# EAGLE design SolarCharger_Rev2 (EAGLE 7.6.0)

## Sheet 1 of 5
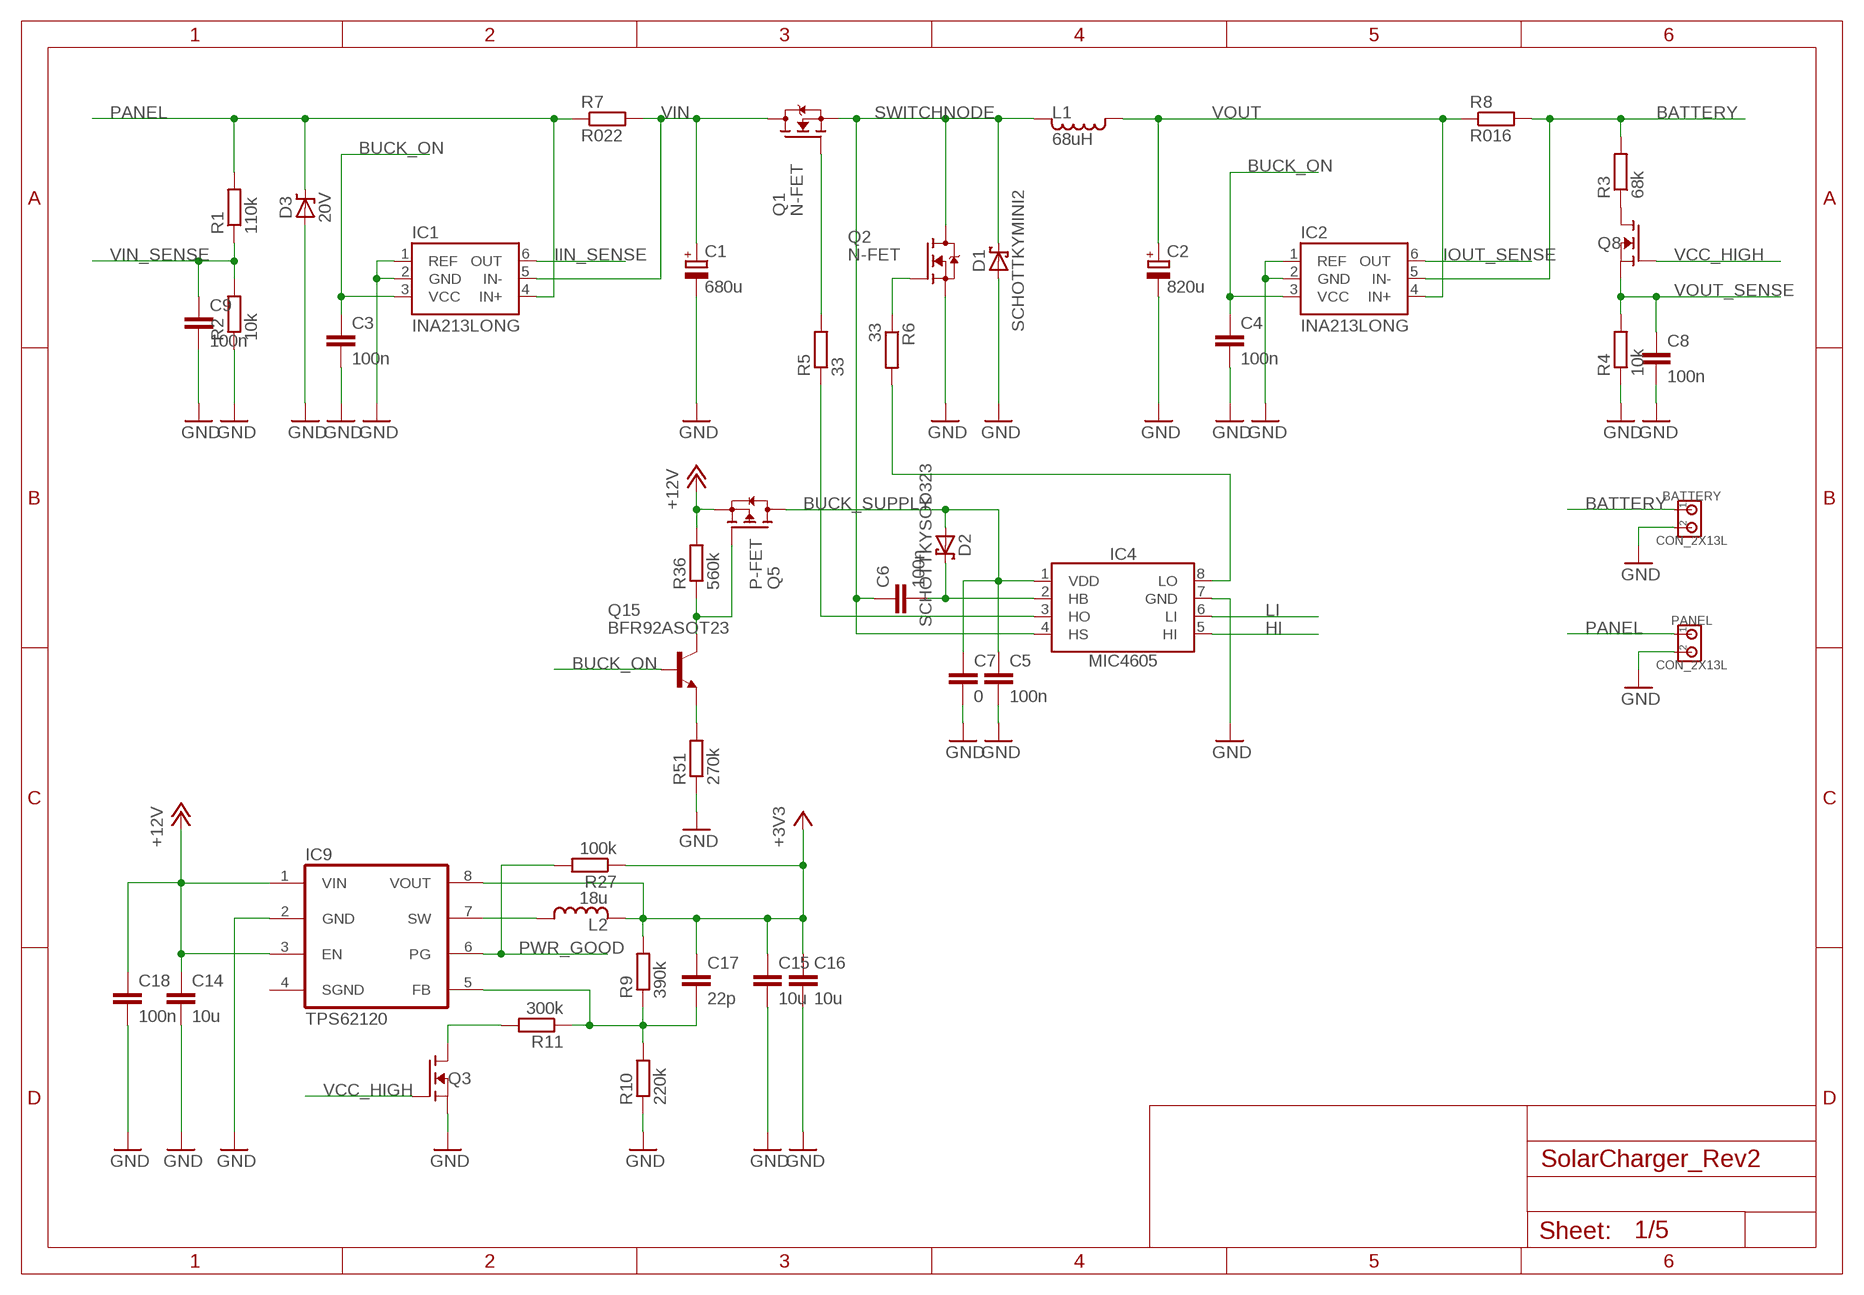
[diagram p0: schematic, sheet 1]

### Parts
BATTERY  CON_2X13L  [200MIL_2X]
C1  680u  C_POLARIZED10MM  [10MM]
C2  820u  C_POLARIZED10MM  [10MM]
C3  100n  CC0805  [C0805]
C4  100n  CC0805  [C0805]
C5  100n  CC0805  [C0805]
C6  100n  CC0805  [C0805]
C7  0  CC0805  [C0805]
C8  100n  CC0805  [C0805]
C9  100n  CC0805  [C0805]
C14  10u  CC1206  [C1206]
C15  10u  CC0805  [C0805]
C16  10u  CC0805  [C0805]
C17  22p  CC0805  [C0805]
C18  100n  CC1206  [C1206]
D1  SCHOTTKYMINI2  [MINI2-F3-B]
D2  SCHOTTKYSOD323  [SOD323]
D3  20V  ZENERSMC  [SMC]
IC1  INA213LONG  [SC70-6_LONG]
IC2  INA213LONG  [SC70-6_LONG]
IC4  MIC4605  [SOIC8]
IC9  TPS62120  [SOT-23-8]
L1  68uH  INDUCTORMSS1583  [MSS1583]
L2  18u  INDUCTORLPS3015  [LPS3015]
PANEL  CON_2X13L  [200MIL_2X]
Q1  N-FET  N-PWR-MOSFETTO263-3  [TO263-3]
Q2  N-FET  N-PWR-MOSFETTO263-3  [TO263-3]
Q3  N-FETSOT23  [SOT23]
Q5  P-FET  [SOT23]
Q8  N-FETSOT23  [SOT23]
Q15  BFR92ASOT23  [SOT23]
R1  110k  RESISTORR0805  [R0805]
R2  10k  RESISTORR0805  [R0805]
R3  68k  RESISTORR0805  [R0805]
R4  10k  RESISTORR0805  [R0805]
R5  33  RESISTORR0805  [R0805]
R6  33  RESISTORR0805  [R0805]
R7  R022  RESISTOR0612  [0612]
R8  R016  RESISTOR0612  [0612]
R9  390k  RESISTORR0805  [R0805]
R10  220k  RESISTORR0805  [R0805]
R11  300k  RESISTORR0805  [R0805]
R27  100k  RESISTORR0805  [R0805]
R36  560k  RESISTORR0805  [R0805]
R51  270k  RESISTORR0805  [R0805]

### Nets
BATTERY: BATTERY.1 IC2.5(IN-) R3.2 R8.2 ; also sheet 4,5
BUCK_ON: C3.1 C4.1 IC1.3(VCC) IC2.3(VCC) Q15.1(B) ; also sheet 2
BUCK_SUPPLY: C5.1 C7.1 D2.A IC4.1(VDD) Q5.3(D)
GND: BATTERY.2 C1.- C2.- C3.2 C4.2 C5.2 C7.2 C8.2 C9.2 C14.2 C15.2 C16.2 C18.2 D1.A D3.A IC1.1(REF) IC1.2(GND) IC2.1(REF) IC2.2(GND) IC4.7(GND) IC9.2(GND) PANEL.2 Q2.3(S) Q3.2(S) R2.1 R4.1 R10.1 R51.1 ; also sheet 2,3,4,5
HI: IC4.5(HI) ; also sheet 2
IIN_SENSE: IC1.6(OUT) ; also sheet 3
IOUT_SENSE: IC2.6(OUT) ; also sheet 3
LI: IC4.6(LI) ; also sheet 2
N$1: C6.2 D2.C IC4.2(HB)
N$4: Q1.1(G) R5.2
N$5: Q3.3(D) R11.2
N$7: Q2.1(G) R6.1
N$8: IC4.8(LO) R6.2
N$9: IC9.7(SW) L2.1
N$11: C17.2 IC9.5(FB) R9.1 R10.2 R11.1
N$14: IC4.3(HO) R5.1
N$16: Q5.1(G) Q15.3(C) R36.1
N$17: Q8.3(D) R3.1
N$19: Q15.2(E) R51.2
PANEL: D3.C IC1.4(IN+) PANEL.1 R1.2 R7.1
PWR_GOOD: IC9.6(PG) R27.2 ; also sheet 2
SWITCHNODE: C6.1 D1.C IC4.4(HS) L1.2 Q1.3(S) Q2.TAB(D)
VCC: C15.1 C16.1 C17.1 IC9.8(VOUT) L2.2 R9.2 R27.1 ; supply symbol labelled +3V3 ; also sheet 2,3
VCC_HIGH: Q3.1(G) Q8.1(G) ; also sheet 2,4
VIN: C1.+ IC1.5(IN-) Q1.TAB(D) R7.2
VIN_SENSE: C9.1 R1.1 R2.2 ; also sheet 3
VOUT: C2.+ C14.1 C18.1 IC2.4(IN+) IC9.1(VIN) IC9.3(EN) L1.1 Q5.2(S) R8.1 R36.2 ; supply symbol labelled +12V ; also sheet 3
VOUT_SENSE: C8.1 Q8.2(S) R4.2 ; also sheet 3
Unconnected: IC9.4(SGND)

## Sheet 2 of 5
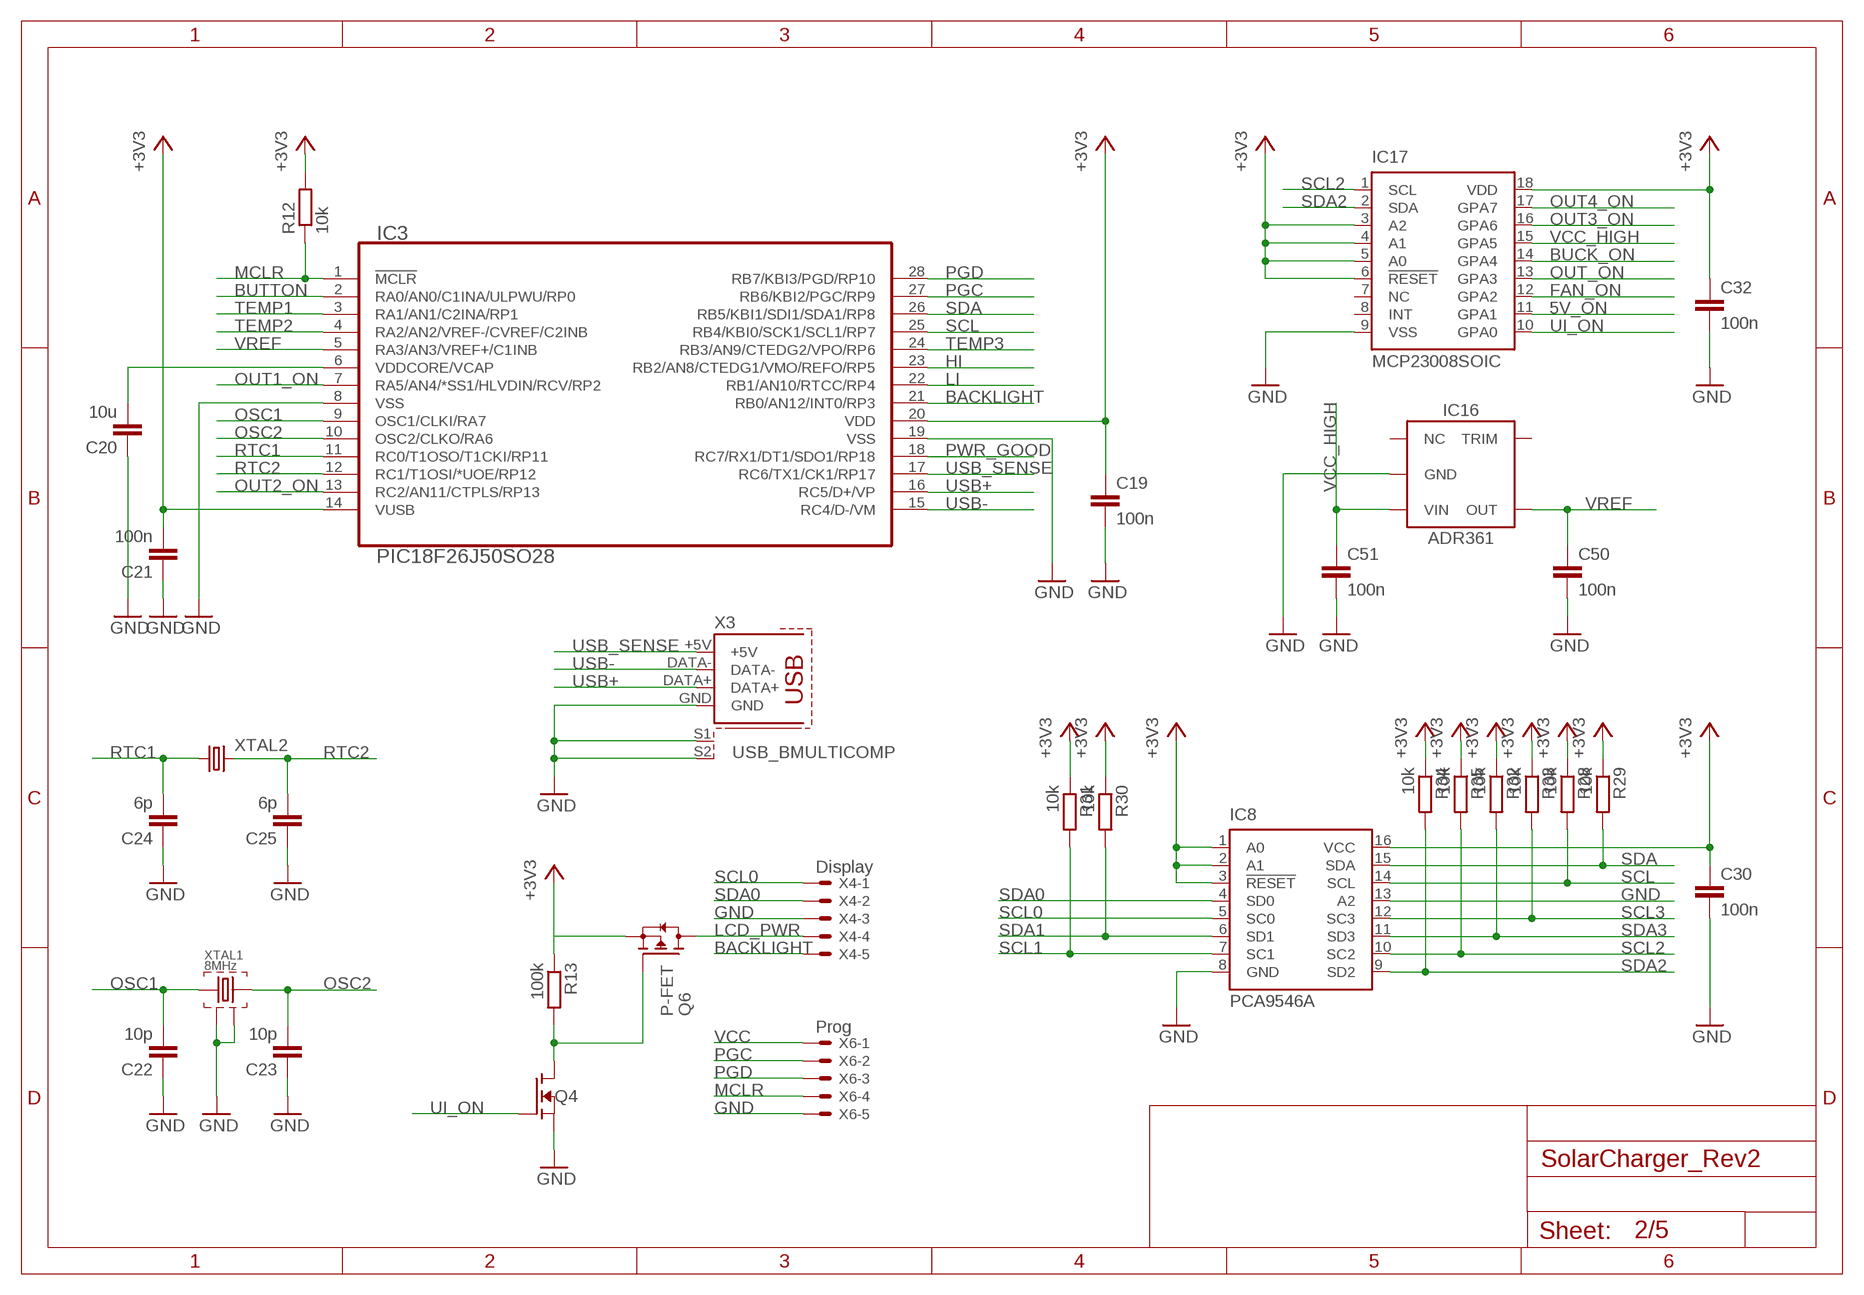
[diagram p1: schematic, sheet 2]

### Parts
C19  100n  CC0805  [C0805]
C20  10u  CC0805  [C0805]
C21  100n  CC0805  [C0805]
C22  10p  CC0805  [C0805]
C23  10p  CC0805  [C0805]
C24  6p  CC0805  [C0805]
C25  6p  CC0805  [C0805]
C30  100n  CC0805  [C0805]
C32  100n  CC0805  [C0805]
C50  100n  CC0805  [C0805]
C51  100n  CC0805  [C0805]
IC3  PIC18F26J50SO28  [SO28W]
IC8  PCA9546A  [SO16]
IC16  ADR361  [SOT23-5]
IC17  MCP23008SOIC  [SO18W]
Q4  N-FETSOT23  [SOT23]
Q6  P-FET  [SOT23]
R12  10k  RESISTORR0805  [R0805]
R13  100k  RESISTORR0805  [R0805]
R28  10k  RESISTORR0805  [R0805]
R29  10k  RESISTORR0805  [R0805]
R30  10k  RESISTORR0805  [R0805]
R31  10k  RESISTORR0805  [R0805]
R32  10k  RESISTORR0805  [R0805]
R33  10k  RESISTORR0805  [R0805]
R34  10k  RESISTORR0805  [R0805]
R35  10k  RESISTORR0805  [R0805]
X3  USB_BMULTICOMP  [USB_B]
X4  Display  22-23-2051  [22-23-2051]
X6  Prog  22-23-2051  [22-23-2051]
XTAL1  8MHz  CRYSTAL_SHIELDED  [5X3.2MM]
XTAL2  CRYSTAL3.2X1.5  [3.2X1.5MM]

### Nets
5V_ON: IC17.11(GPA1) ; also sheet 4
BACKLIGHT: IC3.21(RB0/AN12/INT0/RP3) X4.5
BUCK_ON: IC17.14(GPA4) ; also sheet 1
BUTTON: IC3.2(RA0/AN0/C1INA/ULPWU/RP0) ; also sheet 3
FAN_ON: IC17.12(GPA2) ; also sheet 3
GND: C19.2 C20.1 C21.1 C22.1 C23.1 C24.1 C25.1 C30.2 C32.2 C50.2 C51.2 IC3.8(VSS) IC3.19(VSS) IC8.8(GND) IC8.13(A2) IC16.2(GND) IC17.9(VSS) Q4.2(S) X3.GND X3.S1 X3.S2 X4.3 X6.5 XTAL1.2 XTAL1.4 ; also sheet 1,3,4,5
HI: IC3.23(RB2/AN8/CTEDG1/VMO/REFO/RP5) ; also sheet 1
LCD_PWR: Q6.3(D) X4.4
LI: IC3.22(RB1/AN10/RTCC/RP4) ; also sheet 1
MCLR: IC3.1(!MCLR!) R12.1 X6.4
N$2: Q4.3(D) Q6.1(G) R13.2
N$15: C20.2 IC3.6(VDDCORE/VCAP)
OSC1: C22.2 IC3.9(OSC1/CLKI/RA7) XTAL1.1
OSC2: C23.2 IC3.10(OSC2/CLKO/RA6) XTAL1.3
OUT1_ON: IC3.7(RA5/AN4/*SS1/HLVDIN/RCV/RP2) ; also sheet 5
OUT2_ON: IC3.13(RC2/AN11/CTPLS/RP13) ; also sheet 5
OUT3_ON: IC17.16(GPA6) ; also sheet 5
OUT4_ON: IC17.17(GPA7) ; also sheet 5
OUT_ON: IC17.13(GPA3) ; also sheet 5
PGC: IC3.27(RB6/KBI2/PGC/RP9) X6.2 ; also sheet 3
PGD: IC3.28(RB7/KBI3/PGD/RP10) X6.3 ; also sheet 3
PWR_GOOD: IC3.18(RC7/RX1/DT1/SDO1/RP18) ; also sheet 1
RTC1: C24.2 IC3.11(RC0/T1OSO/T1CKI/RP11) XTAL2.1
RTC2: C25.2 IC3.12(RC1/T1OSI/*UOE/RP12) XTAL2.2
SCL: IC3.25(RB4/KBI0/SCK1/SCL1/RP7) IC8.14(SCL) R28.2
SCL0: IC8.5(SC0) X4.1
SCL1: IC8.7(SC1) R31.2 ; also sheet 3
SCL2: IC8.10(SC2) IC17.1(SCL) R35.2
SCL3: IC8.12(SC3) R33.2 ; also sheet 3
SDA: IC3.26(RB5/KBI1/SDI1/SDA1/RP8) IC8.15(SDA) R29.2
SDA0: IC8.4(SD0) X4.2
SDA1: IC8.6(SD1) R30.2 ; also sheet 3
SDA2: IC8.9(SD2) IC17.2(SDA) R34.2
SDA3: IC8.11(SD3) R32.2 ; also sheet 3
TEMP1: IC3.3(RA1/AN1/C2INA/RP1) ; also sheet 4
TEMP2: IC3.4(RA2/AN2/VREF-/CVREF/C2INB) ; also sheet 4
TEMP3: IC3.24(RB3/AN9/CTEDG2/VPO/RP6) ; also sheet 4
UI_ON: IC17.10(GPA0) Q4.1(G) ; also sheet 3
USB+: IC3.16(RC5/D+/VP) X3.DATA+
USB-: IC3.15(RC4/D-/VM) X3.DATA-
USB_SENSE: IC3.17(RC6/TX1/CK1/RP17) X3.+5V
VCC: C19.1 C21.2 C30.1 C32.1 IC3.14(VUSB) IC3.20(VDD) IC8.1(A0) IC8.2(A1) IC8.3(!RESET!) IC8.16(VCC) IC17.3(A2) IC17.4(A1) IC17.5(A0) IC17.6(!RESET) IC17.18(VDD) Q6.2(S) R12.2 R13.1 R28.1 R29.1 R30.1 R31.1 R32.1 R33.1 R34.1 R35.1 X6.1 ; supply symbol labelled +3V3 ; also sheet 1,3
VCC_HIGH: C51.1 IC16.3(VIN) IC17.15(GPA5) ; also sheet 1,4
VREF: C50.1 IC3.5(RA3/AN3/VREF+/C1INB) IC16.4(OUT)
Unconnected: IC16.1(NC) IC16.5(TRIM) IC17.7(NC) IC17.8(INT)

## Sheet 3 of 5
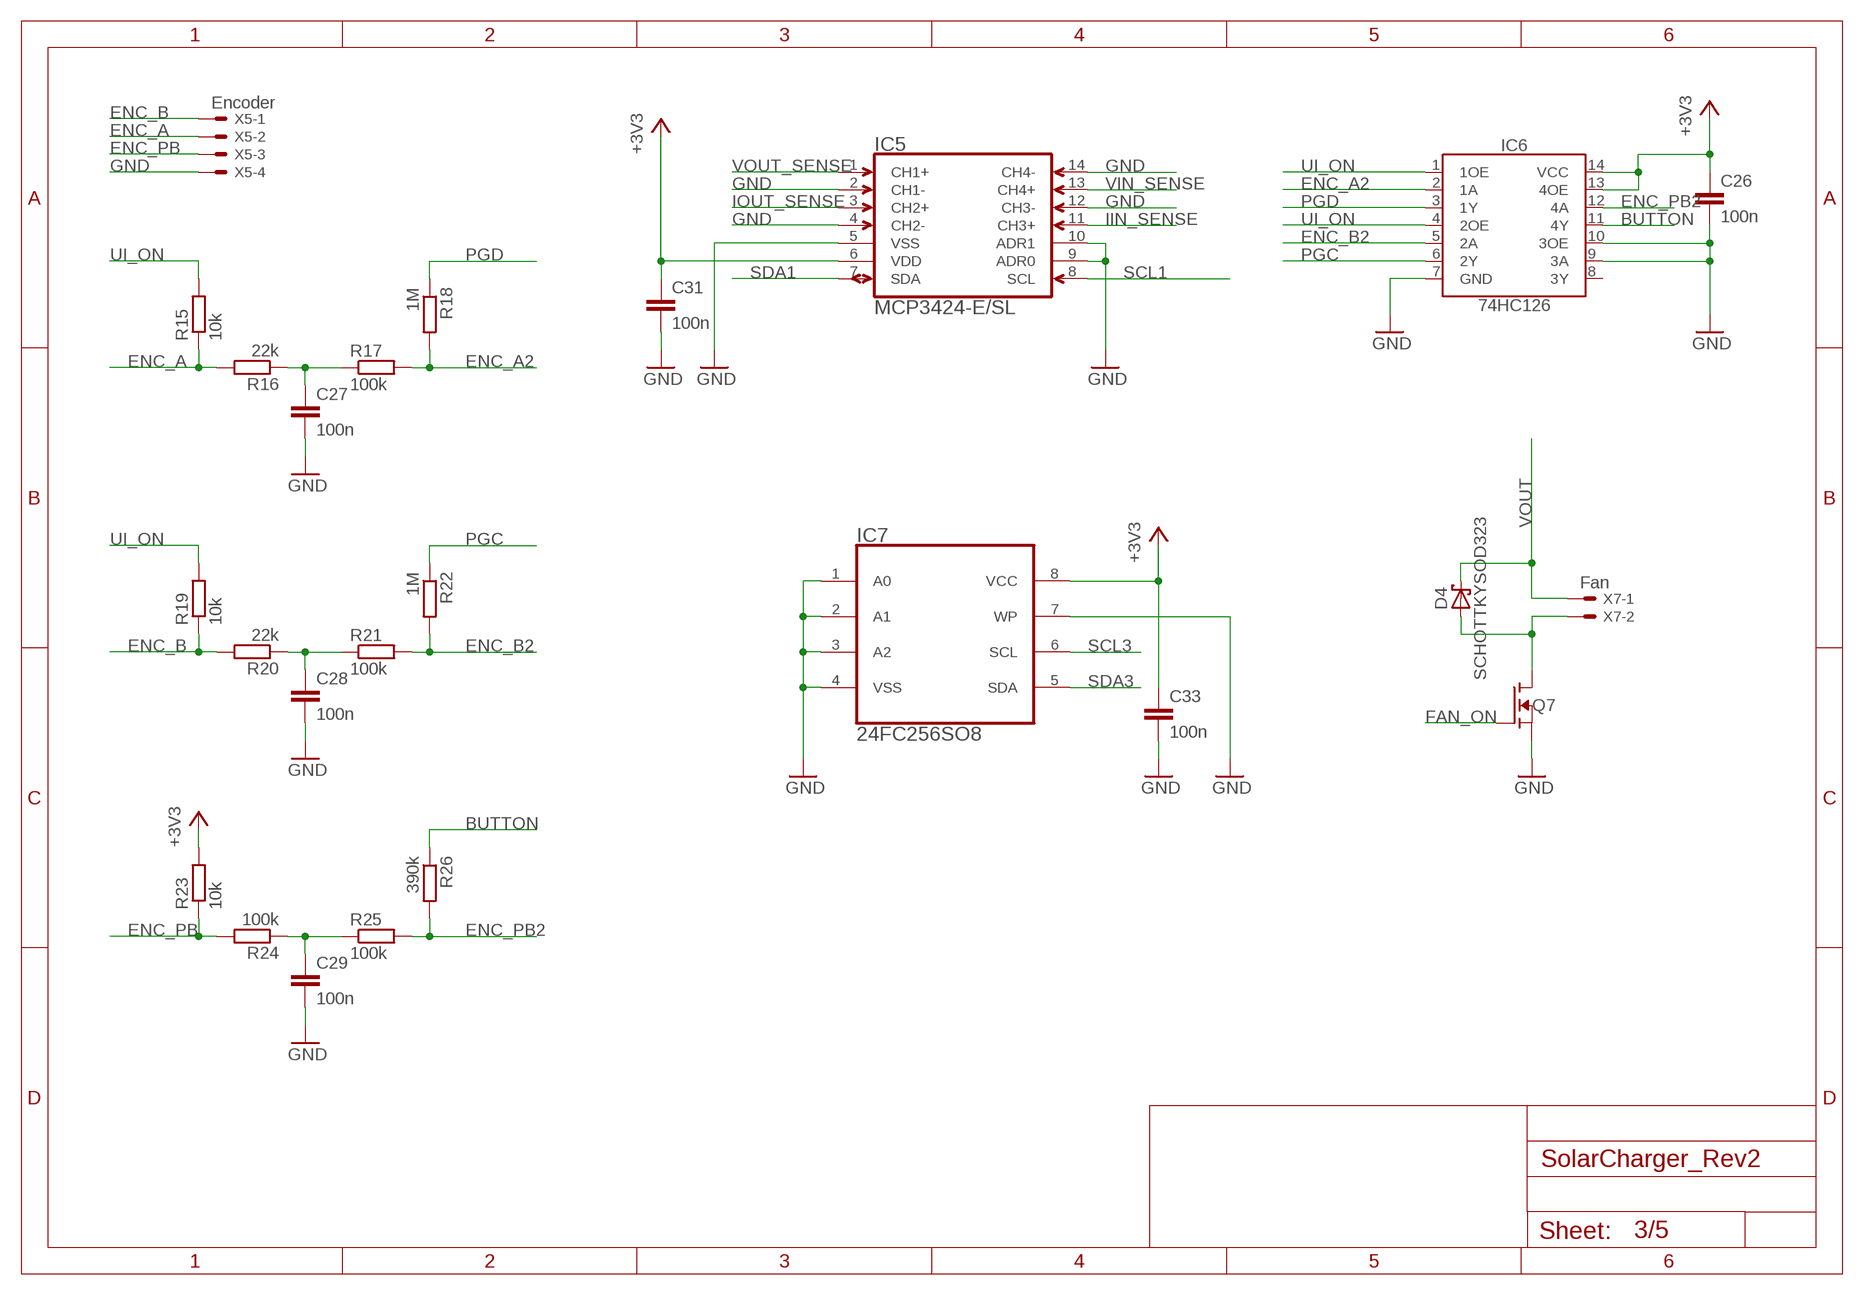
[diagram p2: schematic, sheet 3]

### Parts
C26  100n  CC0805  [C0805]
C27  100n  CC0805  [C0805]
C28  100n  CC0805  [C0805]
C29  100n  CC0805  [C0805]
C31  100n  CC0805  [C0805]
C33  100n  CC0805  [C0805]
D4  SCHOTTKYSOD323  [SOD323]
IC5  MCP3424-E/SL  [SOIC14]
IC6  74HC126  [SO14]
IC7  24FC256SO8  [SOIC8]
Q7  N-FETSOT23  [SOT23]
R15  10k  RESISTORR0805  [R0805]
R16  22k  RESISTORR0805  [R0805]
R17  100k  RESISTORR0805  [R0805]
R18  1M  RESISTORR0805  [R0805]
R19  10k  RESISTORR0805  [R0805]
R20  22k  RESISTORR0805  [R0805]
R21  100k  RESISTORR0805  [R0805]
R22  1M  RESISTORR0805  [R0805]
R23  10k  RESISTORR0805  [R0805]
R24  100k  RESISTORR0805  [R0805]
R25  100k  RESISTORR0805  [R0805]
R26  390k  RESISTORR0805  [R0805]
X5  Encoder  22-23-20411MM  [22-23-2041]
X7  Fan  22-23-2021100MIL  [22-23-2021]

### Nets
BUTTON: IC6.11(4Y) R26.1 ; also sheet 2
ENC_A: R15.1 R16.2 X5.2
ENC_A2: IC6.2(1A) R17.2 R18.2
ENC_B: R19.1 R20.2 X5.1
ENC_B2: IC6.5(2A) R21.2 R22.2
ENC_PB: R23.1 R24.2 X5.3
ENC_PB2: IC6.12(4A) R25.2 R26.2
FAN_ON: Q7.1(G) ; also sheet 2
GND: C26.2 C27.2 C28.2 C29.2 C31.2 C33.2 IC5.2(CH1-) IC5.4(CH2-) IC5.5(VSS) IC5.9(ADR0) IC5.10(ADR1) IC5.12(CH3-) IC5.14(CH4-) IC6.7(GND) IC6.9(3A) IC6.10(3OE) IC7.1(A0) IC7.2(A1) IC7.3(A2) IC7.4(VSS) IC7.7(WP) Q7.2(S) X5.4 ; also sheet 1,2,4,5
IIN_SENSE: IC5.11(CH3+) ; also sheet 1
IOUT_SENSE: IC5.3(CH2+) ; also sheet 1
N$6: C28.1 R20.1 R21.1
N$10: D4.A Q7.3(D) X7.2
N$12: C27.1 R16.1 R17.1
N$13: C29.1 R24.1 R25.1
PGC: IC6.6(2Y) R22.1 ; also sheet 2
PGD: IC6.3(1Y) R18.1 ; also sheet 2
SCL1: IC5.8(SCL) ; also sheet 2
SCL3: IC7.6(SCL) ; also sheet 2
SDA1: IC5.7(SDA) ; also sheet 2
SDA3: IC7.5(SDA) ; also sheet 2
UI_ON: IC6.1(1OE) IC6.4(2OE) R15.2 R19.2 ; also sheet 2
VCC: C26.1 C31.1 C33.1 IC5.6(VDD) IC6.13(4OE) IC6.14(VCC) IC7.8(VCC) R23.2 ; supply symbol labelled +3V3 ; also sheet 1,2
VIN_SENSE: IC5.13(CH4+) ; also sheet 1
VOUT: D4.C X7.1 ; also sheet 1
VOUT_SENSE: IC5.1(CH1+) ; also sheet 1
Unconnected: IC6.8(3Y)

## Sheet 4 of 5
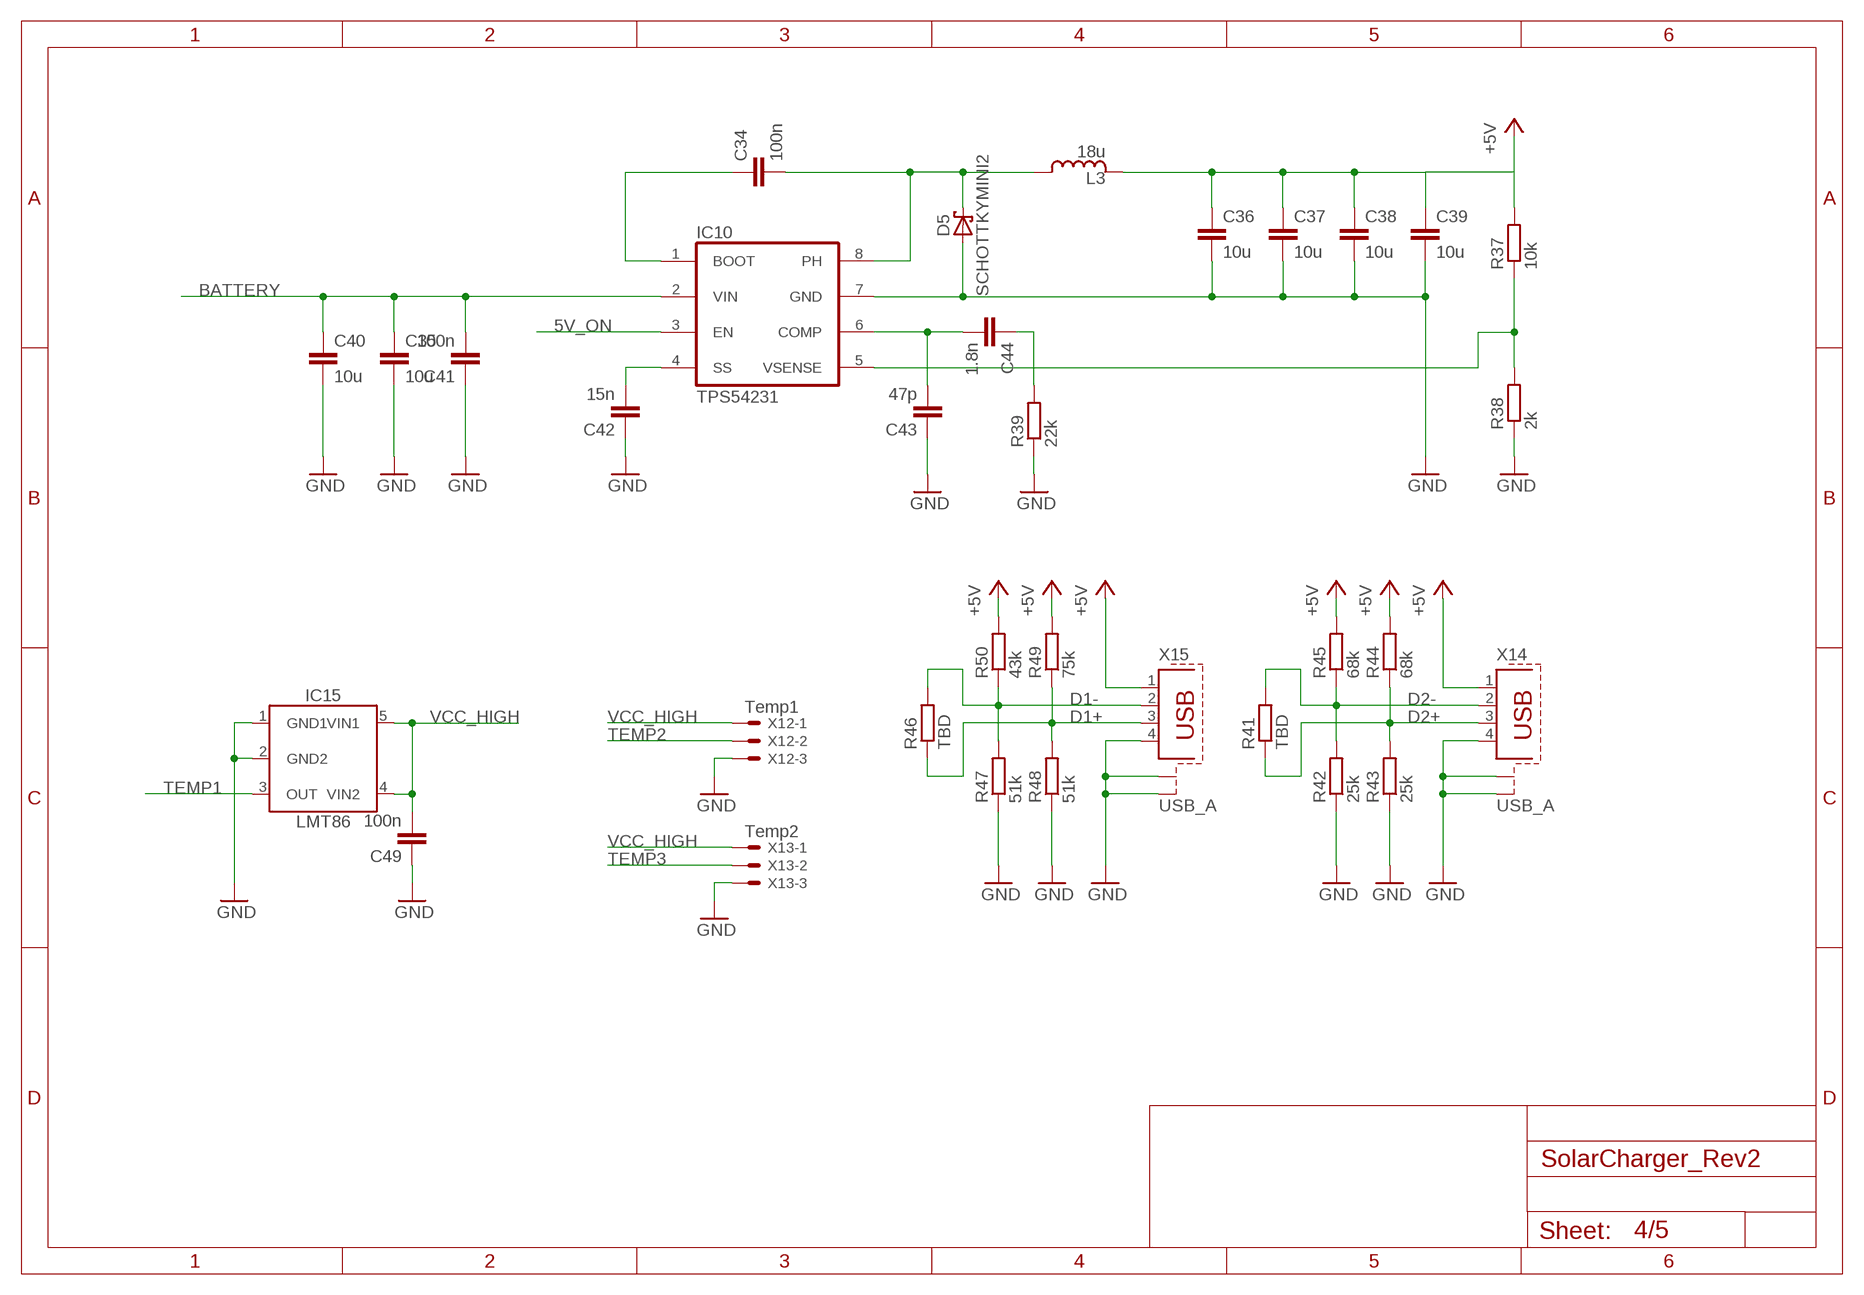
[diagram p3: schematic, sheet 4]

### Parts
C34  100n  CC0805  [C0805]
C35  10u  CC1206  [C1206]
C36  10u  CC1206  [C1206]
C37  10u  CC1206  [C1206]
C38  10u  CC1206  [C1206]
C39  10u  CC1206  [C1206]
C40  10u  CC1206  [C1206]
C41  100n  CC0805  [C0805]
C42  15n  CC0805  [C0805]
C43  47p  CC0805  [C0805]
C44  1.8n  CC0805  [C0805]
C49  100n  CC0805  [C0805]
D5  SCHOTTKYMINI2  [MINI2-F3-B]
IC10  TPS54231  [SO8]
IC15  LMT86  [SC70-5]
L3  18u  INDUCTORMSS1038  [MSS1038]
R37  10k  RESISTORR0805  [R0805]
R38  2k  RESISTORR0805  [R0805]
R39  22k  RESISTORR0805  [R0805]
R41  TBD  RESISTORR0805  [R0805]
R42  25k  RESISTORR0805  [R0805]
R43  25k  RESISTORR0805  [R0805]
R44  68k  RESISTORR0805  [R0805]
R45  68k  RESISTORR0805  [R0805]
R46  TBD  RESISTORR0805  [R0805]
R47  51k  RESISTORR0805  [R0805]
R48  51k  RESISTORR0805  [R0805]
R49  75k  RESISTORR0805  [R0805]
R50  43k  RESISTORR0805  [R0805]
X12  Temp1  22-23-2031  [22-23-2031]
X13  Temp2  22-23-2031  [22-23-2031]
X14  USB_A  [USB_A]
X15  USB_A  [USB_A]

### Nets
5V_ON: IC10.3(EN) ; also sheet 2
+5V: C36.1 C37.1 C38.1 C39.1 L3.2 R37.2 R44.2 R45.2 R49.2 R50.2 X14.1 X15.1
BATTERY: C35.1 C40.1 C41.2 IC10.2(VIN) ; also sheet 1,5
D1+: R46.1 R48.2 R49.1 X15.3
D1-: R46.2 R47.2 R50.1 X15.2
D2+: R41.1 R43.2 R44.1 X14.3
D2-: R41.2 R42.2 R45.1 X14.2
GND: C35.2 C36.2 C37.2 C38.2 C39.2 C40.2 C41.1 C42.1 C43.1 C49.1 D5.A IC10.7(GND) IC15.1(GND1) IC15.2(GND2) R38.1 R39.1 R42.1 R43.1 R47.1 R48.1 X12.3 X13.3 X14.4 X14.S1 X14.S2 X15.4 X15.S1 X15.S2 ; also sheet 1,2,3,5
N$18: C34.1 IC10.1(BOOT)
N$20: C42.2 IC10.4(SS)
N$21: C34.2 D5.C IC10.8(PH) L3.1
N$22: IC10.5(VSENSE) R37.1 R38.2
N$25: C44.1 R39.2
N$26: C43.2 C44.2 IC10.6(COMP)
TEMP1: IC15.3(OUT) ; also sheet 2
TEMP2: X12.2 ; also sheet 2
TEMP3: X13.2 ; also sheet 2
VCC_HIGH: C49.2 IC15.4(VIN2) IC15.5(VIN1) X12.1 X13.1 ; also sheet 1,2

## Sheet 5 of 5
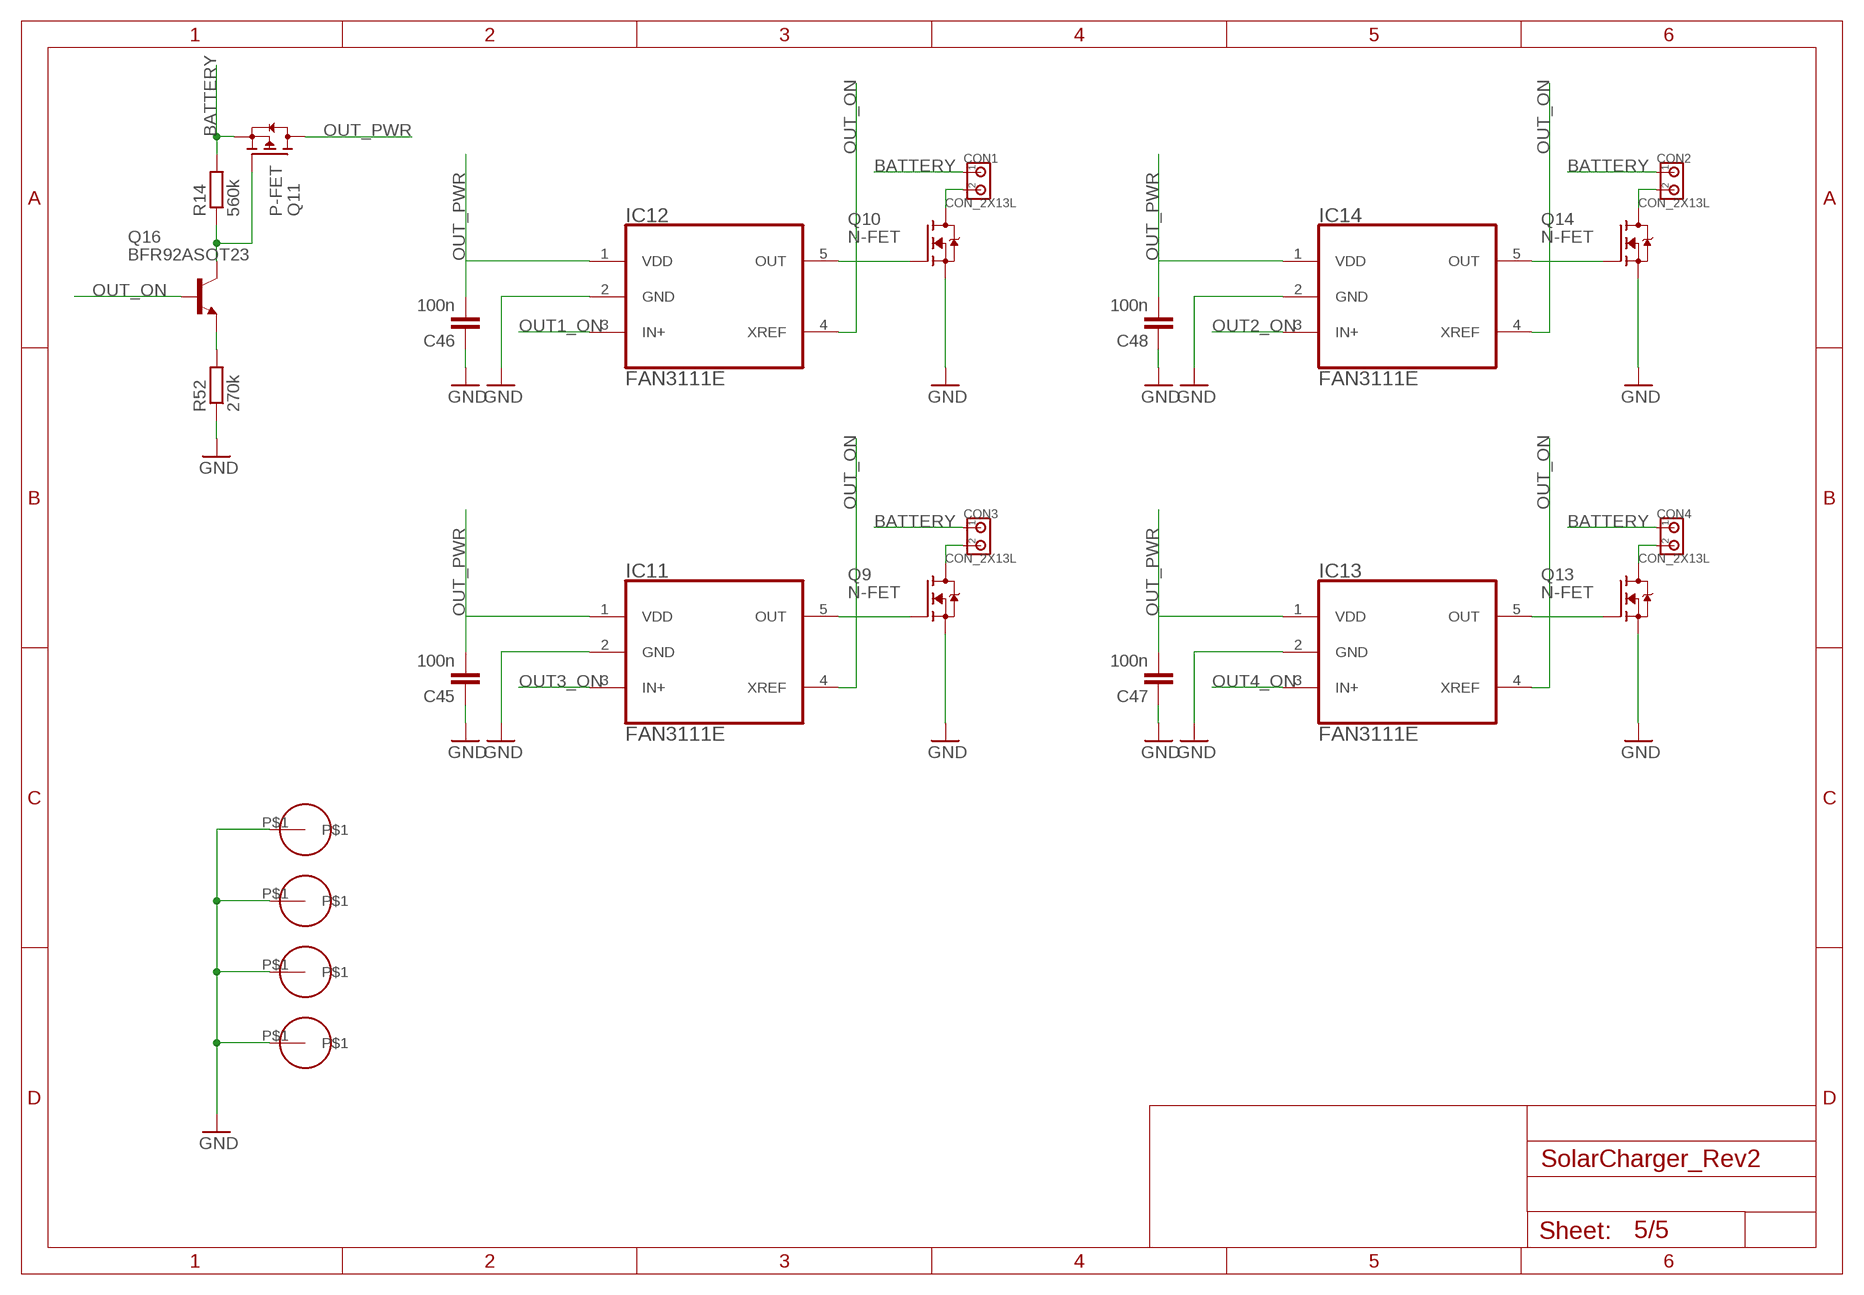
[diagram p4: schematic, sheet 5]

### Parts
C45  100n  CC0805  [C0805]
C46  100n  CC0805  [C0805]
C47  100n  CC0805  [C0805]
C48  100n  CC0805  [C0805]
CON1  CON_2X13L  [200MIL_2X]
CON2  CON_2X13L  [200MIL_2X]
CON3  CON_2X13L  [200MIL_2X]
CON4  CON_2X13L  [200MIL_2X]
IC11  FAN3111E  [SOT-23-5]
IC12  FAN3111E  [SOT-23-5]
IC13  FAN3111E  [SOT-23-5]
IC14  FAN3111E  [SOT-23-5]
Q9  N-FET  N-PWR-MOSFETTO263-3  [TO263-3]
Q10  N-FET  N-PWR-MOSFETTO263-3  [TO263-3]
Q11  P-FET  [SOT23]
Q13  N-FET  N-PWR-MOSFETTO263-3  [TO263-3]
Q14  N-FET  N-PWR-MOSFETTO263-3  [TO263-3]
Q16  BFR92ASOT23  [SOT23]
R14  560k  RESISTORR0805  [R0805]
R52  270k  RESISTORR0805  [R0805]
U$1  HOLE_3.3MM  [HOLE_3.3MM]
U$2  HOLE_3.3MM  [HOLE_3.3MM]
U$3  HOLE_3.3MM  [HOLE_3.3MM]
U$4  HOLE_3.3MM  [HOLE_3.3MM]

### Nets
BATTERY: CON1.1 CON2.1 CON3.1 CON4.1 Q11.2(S) R14.2 ; also sheet 1,4
GND: C45.1 C46.1 C47.1 C48.1 IC11.2(GND) IC12.2(GND) IC13.2(GND) IC14.2(GND) Q9.3(S) Q10.3(S) Q13.3(S) Q14.3(S) R52.1 U$1.P$1 U$2.P$1 U$3.P$1 U$4.P$1 ; also sheet 1,2,3,4
N$3: Q11.1(G) Q16.3(C) R14.1
N$23: CON3.2 Q9.TAB(D)
N$24: IC11.5(OUT) Q9.1(G)
N$27: CON1.2 Q10.TAB(D)
N$28: IC12.5(OUT) Q10.1(G)
N$30: CON4.2 Q13.TAB(D)
N$31: IC13.5(OUT) Q13.1(G)
N$32: CON2.2 Q14.TAB(D)
N$33: IC14.5(OUT) Q14.1(G)
N$34: Q16.2(E) R52.2
OUT1_ON: IC12.3(IN+) ; also sheet 2
OUT2_ON: IC14.3(IN+) ; also sheet 2
OUT3_ON: IC11.3(IN+) ; also sheet 2
OUT4_ON: IC13.3(IN+) ; also sheet 2
OUT_ON: IC11.4(XREF) IC12.4(XREF) IC13.4(XREF) IC14.4(XREF) Q16.1(B) ; also sheet 2
OUT_PWR: C45.2 C46.2 C47.2 C48.2 IC11.1(VDD) IC12.1(VDD) IC13.1(VDD) IC14.1(VDD) Q11.3(D)

## Library data of the parts
BATTERY CON1-CON4 PANEL = 00Connector:CON_2X: 2-pin header
C1 C2 = 00Capacitor:C_POLARIZED
C3-C9 C14-C51 = 00Capacitor:C: Capacitor
D1 D2 D4 D5 = 00Diode:SCHOTTKY
D3 = 00Diode:ZENER
IC1 IC2 = 00Sensor:INA21*: Current-Shunt Monitors Voltage Output, Low- or High-Side Measurement, Bidirectional, Zero-Drift Series; GAIN: 50
IC3 = 00PIC:PIC18F*J50: PIC18F Series 28-Pin Microcontroller; MEMORY: 64k
IC4 = 00Logic:MIC4605: 85V Half-Bridge MOSFET Driver with adaptive Dead Time
IC5 = 00ADC:MCP3424-E/SL: 4-Channel, 18-bit ADC
IC6 = 00Logic:74HC126: Quad buffer/line driver; 3-state
IC7 = 00Logic:24FC256: 256K I2C CMOS Serial EEPROM
IC8 = 00Logic:PCA9546A: I2C 4x Multiplexer
IC9 = 00VoltageRegulator:TPS62120: 15V, 75mA, 800kHz High Efficient Buck Converter
IC10 = 00VoltageRegulator:TPS54231: 2A, 28V Input, Step-Down DC-DC Converter
IC11-IC14 = 00Logic:FAN3111E: Single 1A High-Speed, Low-Side Gate Driver
IC15 = 00Sensor:LMT86: Analog Temperature Sensors with Class-AB Output
IC16 = 00VoltageReference:ADR36*: Voltage Reference; VOLTAGE: 2.5
IC17 = 00Logic:MCP23008: 8bit I2C Port Extender
L1-L3 = 00Inductor:INDUCTOR
Q1 Q2 Q9 Q10 Q13 Q14 = 00Mosfet:N-PWR-MOSFET
Q3 Q4 Q7 Q8 = 00Mosfet:N-FET: N-Channel MOSFET
Q5 Q6 Q11 = 00Mosfet:P-FET
Q15 Q16 = 00Transistor:BFR92A
R1-R39 R41-R52 = 00Resistor:RESISTOR: RESISTOR, European symbol
U$1-U$4 = 00Drill:HOLE_3.3MM
X3 = 00Connector:USB_B: Type B USB connector
X4 X6 = 00Connector:22-23-2051: .100" (2.54mm) Center Header - 5 Pin; MF: MOLEX; MPN: 22-23-2051; OC_FARNELL: 1462952; OC_NEWARK: 38C9178
X5 = 00Connector:22-23-2041: .100" (2.54mm) Center Header - 4 Pin
X7 = 00Connector:22-23-2021: .100" (2.54mm) Center Header - 2 Pin; MF: MOLEX; MPN: 22-23-2021; OC_FARNELL: 1462926; OC_NEWARK: 25C3832
X12 X13 = 00Connector:22-23-2031: .100" (2.54mm) Center Header - 3 Pin; MF: MOLEX; MPN: 22-23-2031; OC_FARNELL: 1462950; OC_NEWARK: 30C0862
X14 X15 = 00Connector:USB_A
XTAL1 = 00Crystal:CRYSTAL_SHIELDED: Shielded Crystal
XTAL2 = 00Crystal:CRYSTAL: Crystal

## Board
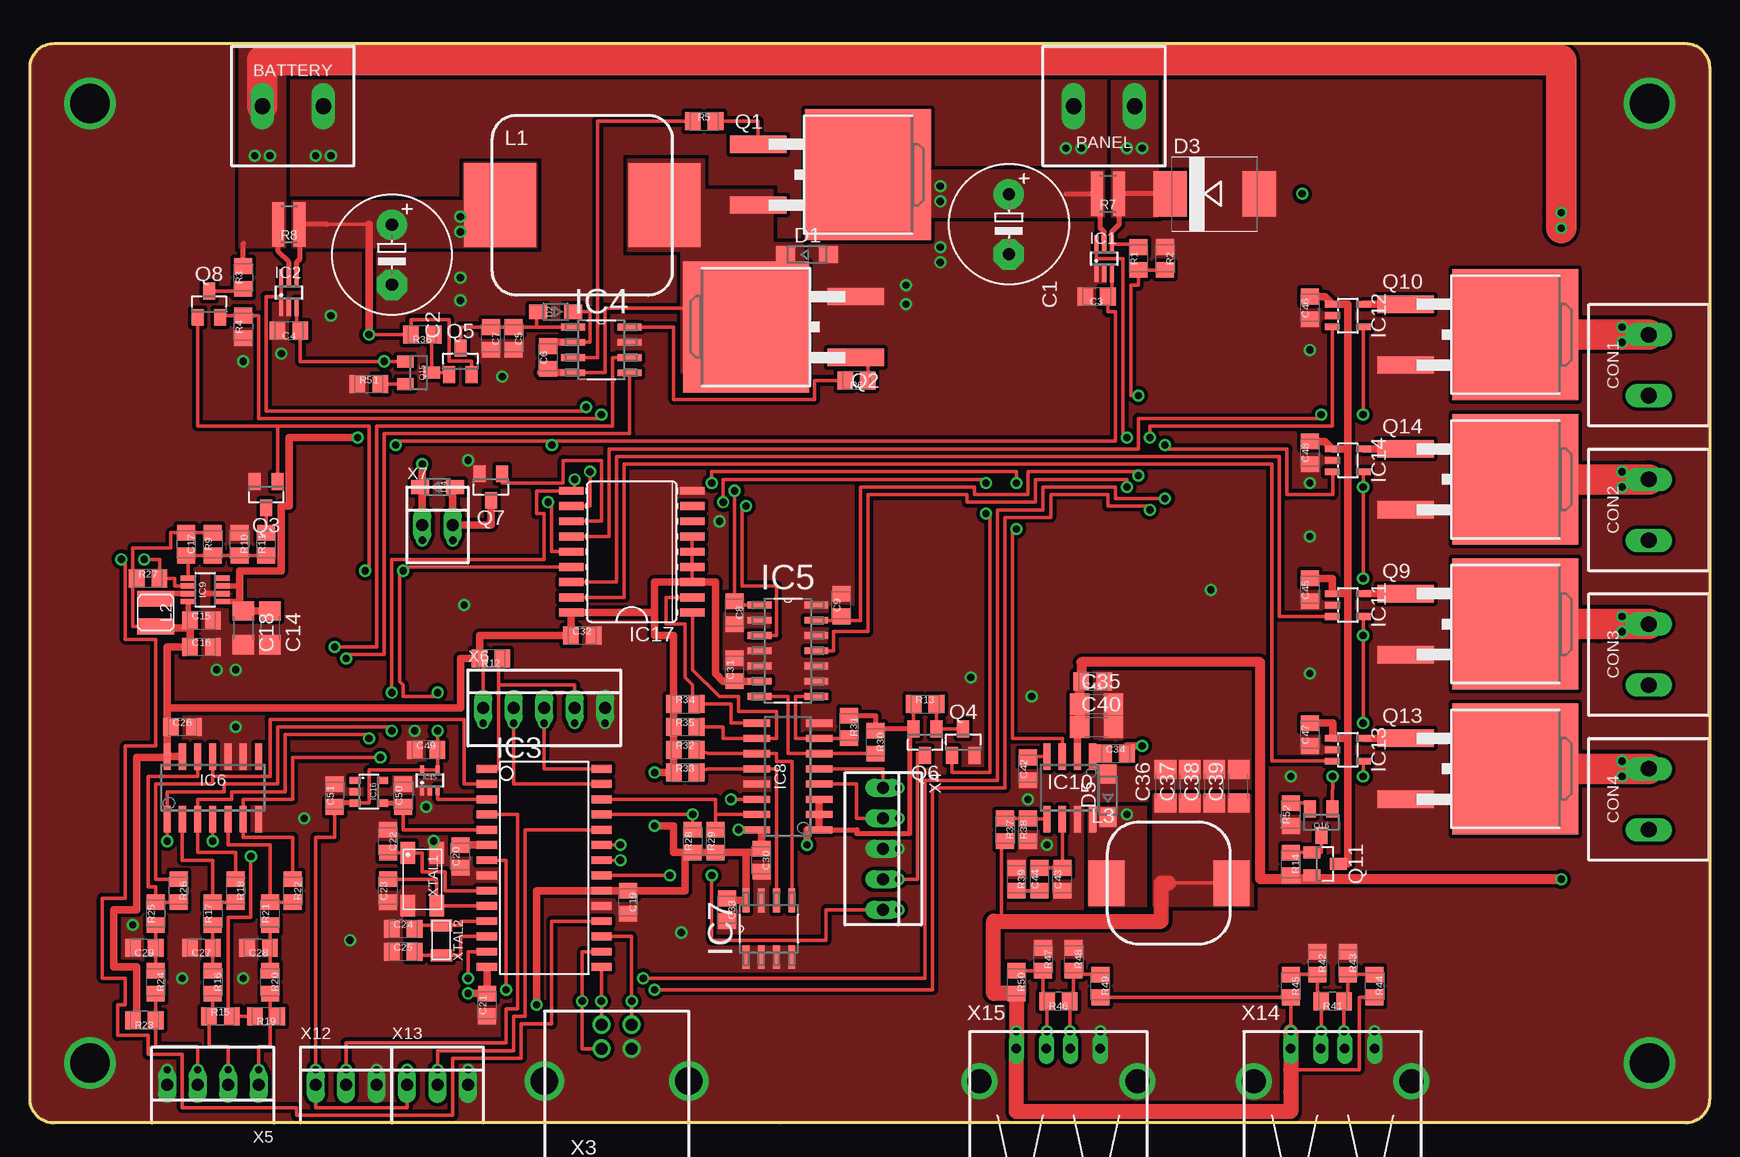
[diagram p5: board, top side]
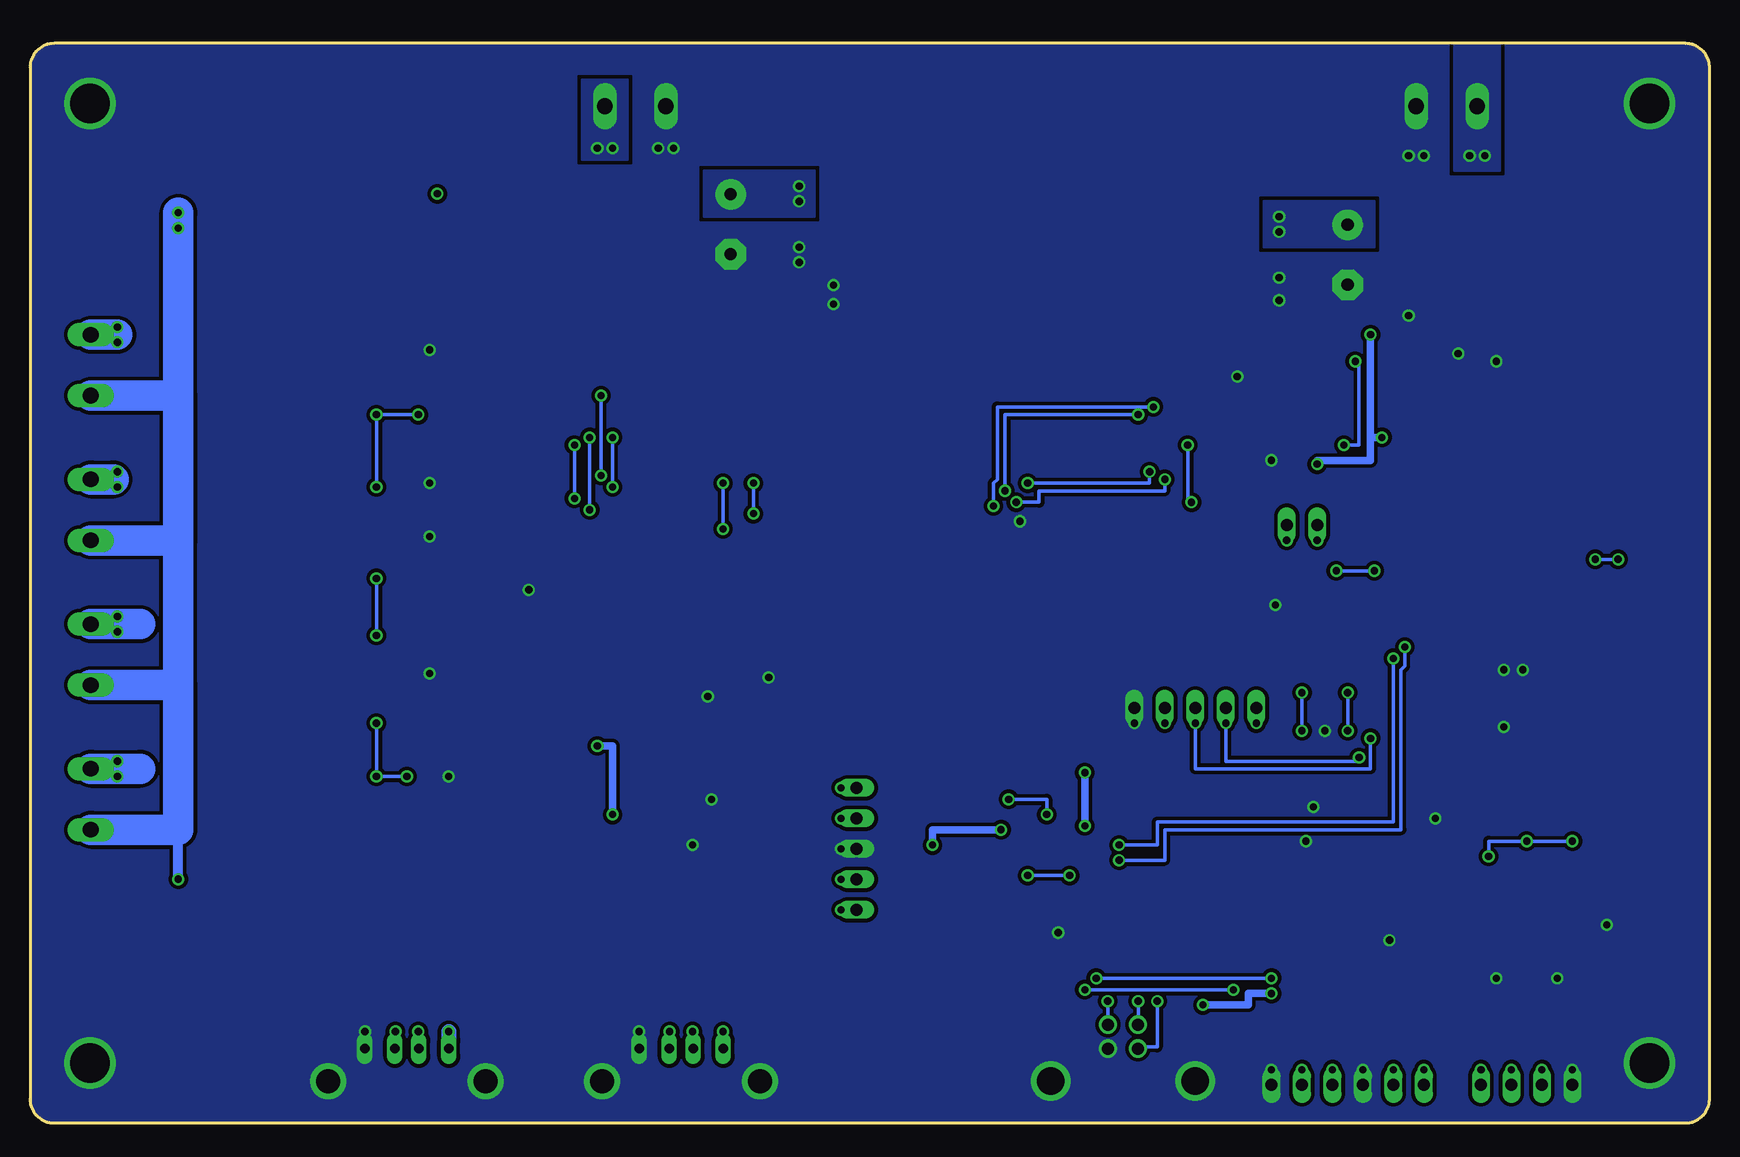
[diagram p6: board, bottom side, seen from below]

Size 140 x 90 mm. Coordinates in mm from the lower left corner, seen from the top.
Outline: 62.5,0 138,0 arc90 140,2 140,88 arc90 138,90 2,90 arc90 0,88 0,2 arc90 2,0 62.48,0
Outline: 62.48,0 arc-90 62.5,0
Outline: 62.5,0 62.48,0
Copper layers (1*16): Top 0.035mm / dielectric 1.5mm / Bottom 0.035mm
Design rules "default *": minimum track width 10mil, minimum drill 24mil, track to track 8mil, track to pad 8mil, pad to pad 8mil, via to via 8mil, smd to smd 8mil, copper to edge 0mil, drill to drill 8mil, minimum pad ring 10mil, minimum via ring 8mil, stop-mask expansion 4mil, vias tented up to drill 0mil, thermal gap 10mil

### Footprints (pad centres in the part's own frame; a part is rotated, then mirrored left to right if it is on the bottom)
200MIL_2X = drill 1.3 long: 1 -2.54,0; 2 2.54,0
10MM = drill 1.016 pad 2.54: + -2.5,0 | drill 1.016 pad 2.54 octagon: - 2.5,0
C0805 = smd 1.3 x 1.5: 1 -0.95,0; 2 0.95,0
C1206 = smd 1.6 x 1.8: 1 -1.4,0; 2 1.4,0
MINI2-F3-B = smd 1.6 x 1.4: A 1.8,0; C -1.8,0
SOD323 = smd 1.5 x 1.2: A 1.45,0; C -1.45,0
SMC = smd 2.8 x 3.8: A 3.7,0; C -3.7,0
SC70-6_LONG = smd 0.35 x 1.5: 1 -0.65,-1.2; 2 0,-1.2; 3 0.65,-1.2; 4 0.65,1.2; 5 0,1.2; 6 -0.65,1.2
SO28W = smd 0.65 x 1.7: 1 -7.62,-4.78; 2 -6.35,-4.78; 3 -5.08,-4.78; 4 -3.81,-4.78; 5 -2.54,-4.78; 6 -1.27,-4.78; 7 0,-4.78; 8 1.27,-4.78; 9 2.54,-4.78; 10 3.81,-4.78; 11 5.08,-4.78; 12 6.35,-4.78; 13 7.62,-4.78; 14 8.89,-4.78; 15 8.89,4.78; 16 7.62,4.78; 17 6.35,4.78; 18 5.08,4.78; 19 3.81,4.78; 20 2.54,4.78; 21 1.27,4.78; 22 0,4.78; 23 -1.27,4.78; 24 -2.54,4.78; 25 -3.81,4.78; 26 -5.08,4.78; 27 -6.35,4.78; 28 -7.62,4.78
SOIC8 = smd 1.981 x 0.559: 1 -2.362,1.905; 2 -2.362,0.635; 3 -2.362,-0.635; 4 -2.362,-1.905; 5 2.362,-1.905; 6 2.362,-0.635; 7 2.362,0.635; 8 2.362,1.905
SOIC14 = smd 1.981 x 0.559: 1 -2.362,3.81; 2 -2.362,2.54; 3 -2.362,1.27; 4 -2.362,0; 5 -2.362,-1.27; 6 -2.362,-2.54; 7 -2.362,-3.81; 8 2.362,-3.81; 9 2.362,-2.54; 10 2.362,-1.27; 11 2.362,0; 12 2.362,1.27; 13 2.362,2.54; 14 2.362,3.81
SO14 = smd 0.6 x 2.2: 1 -3.81,-2.6; 2 -2.54,-2.6; 3 -1.27,-2.6; 4 0,-2.6; 5 1.27,-2.6; 6 2.54,-2.6; 7 3.81,-2.6; 8 3.81,2.6; 9 2.54,2.6; 10 1.27,2.6; 11 0,2.6; 12 -1.27,2.6; 13 -2.54,2.6; 14 -3.81,2.6
SO16 = smd 0.6 x 2.2: 1 -4.445,-2.6; 2 -3.175,-2.6; 3 -1.905,-2.6; 4 -0.635,-2.6; 5 0.635,-2.6; 6 1.905,-2.6; 7 3.175,-2.6; 8 4.445,-2.6; 9 4.445,2.6; 10 3.175,2.6; 11 1.905,2.6; 12 0.635,2.6; 13 -0.635,2.6; 14 -1.905,2.6; 15 -3.175,2.6; 16 -4.445,2.6
SOT-23-8 = smd 0.45 x 1.3: 1 -0.975,-1.4; 2 -0.325,-1.4; 3 0.325,-1.4; 4 0.975,-1.4; 5 0.975,1.4; 6 0.325,1.4; 7 -0.325,1.4; 8 -0.975,1.4
SO8 = smd 2.2 x 0.6: 1 -2.6,1.905; 2 -2.6,0.635; 3 -2.6,-0.635; 4 -2.6,-1.905; 5 2.6,-1.905; 6 2.6,-0.635; 7 2.6,0.635; 8 2.6,1.905
SOT-23-5 = smd 0.55 x 1.2: 1 -0.95,-1.3; 2 0,-1.3; 3 0.95,-1.3; 4 0.95,1.3; 5 -0.95,1.3
SC70-5 = smd 0.35 x 0.8: 1 -0.65,-0.85; 2 0,-0.85; 3 0.65,-0.85; 4 0.65,0.85; 5 -0.65,0.85
SOT23-5 = smd 0.6 x 0.9: 1 -0.95,-1.15; 2 0,-1.15; 3 0.95,-1.15; 4 0.95,1.15; 5 -0.95,1.15
SO18W = smd 0.66 x 2.032: 1 -5.08,-5.029; 2 -3.81,-5.029; 3 -2.54,-5.029; 4 -1.27,-5.029; 5 0,-5.029; 6 1.27,-5.029; 7 2.54,-5.029; 8 3.81,-5.029; 9 5.08,-5.029; 10 5.08,5.029; 11 3.81,5.029; 12 2.54,5.029; 13 1.27,5.029; 14 0,5.029; 15 -1.27,5.029; 16 -2.54,5.029; 17 -3.81,5.029; 18 -5.08,5.029
MSS1583 = smd 6 x 7: 1 -6.85,0; 2 6.85,0
LPS3015 = smd 1.3 x 3.05: 1 -1.15,0; 2 1.15,0
MSS1038 = smd 3 x 3.8: 1 -5.2,0; 2 5.2,0
TO263-3 = smd 1.45 x 4.7: 1 -2.54,-5.65; 3 2.54,-5.65 | smd 10.9 x 10.5: TAB 0,3.5
SOT23 = smd 1 x 1.4: 1 -0.95,-1.1; 2 0.95,-1.1; 3 0,1.1
R0805 = smd 1.3 x 1.5: 1 -0.95,0; 2 0.95,0
0612 = smd 1 x 3.7: 1 -0.9,0; 2 0.9,0
HOLE_3.3MM = drill 3.3: P$1 0,0
USB_B = drill 1: +5V 1.25,4.71; DATA+ -1.25,2.71; DATA- -1.25,4.71; GND 1.25,2.71 | drill 2.3 pad 2.9: S1 -6.02,0; S2 6.02,0
22-23-2051 = drill 1 long: 1 -5.08,0; 2 -2.54,0; 3 0,0; 4 2.54,0; 5 5.08,0
22-23-2041 = drill 1 long: 1 -3.81,0; 2 -1.27,0; 3 1.27,0; 4 3.81,0
22-23-2021 = drill 1 long: 1 -1.27,0; 2 1.27,0
22-23-2031 = drill 1 long: 1 -2.54,0; 2 0,0; 3 2.54,0
USB_A = drill 0.8 long: 1 -3.5,2.71; 2 -1,2.71; 3 1,2.71; 4 3.5,2.71 | drill 2 pad 2.9: S1 -6.57,0; S2 6.57,0
5X3.2MM = smd 1.8 x 1.2: 1 -2.2,-1.2; 2 2.2,-1.2; 3 2.2,1.2; 4 -2.2,1.2
3.2X1.5MM = smd 1 x 1.8: 1 -1.25,0; 2 1.25,0

### Placement (x,y rotation side)
BATTERY  21.91,84.77 0 top
C1  81.6,74.93 270 top
C2  30.16,72.39 270 top
C3  88.9,68.9 180 top
C4  21.59,66.04 180 top
C5  40.32,65.41 270 top
C6  43.18,63.82 90 top
C7  38.42,65.41 270 top
C8  58.74,42.55 270 top
C9  67.63,43.18 90 top
C14  20,41.27 270 top
C15  14.29,41.91 0 top
C16  14.29,39.69 0 top
C17  13.02,48.26 270 top
C18  17.78,41.27 270 top
C19  49.85,18.41 270 top
C20  35.88,22.23 90 top
C21  38.1,9.84 90 top
C22  29.84,23.5 270 top
C23  29.84,19.37 90 top
C24  31.11,16.19 0 top
C25  31.11,14.29 0 top
C26  12.7,33.02 0 top
C27  14.29,14.61 180 top
C28  19.05,14.61 180 top
C29  9.53,14.61 180 top
C30  60.96,21.91 270 top
C31  58.74,37.78 90 top
C32  46.04,40.64 0 top
C33  58.1,17.78 270 top
C34  90.49,30.8 0 top
C35  88.9,34.92 0 top
C36  94.64,28.08 90 top
C37  96.68,28.08 90 top
C38  98.71,28.08 90 top
C39  100.74,28.08 90 top
C40  88.9,33.02 0 top
C41  88.58,36.83 180 top
C42  83.19,29.53 90 top
C43  86.04,20.32 90 top
C44  84.14,20.32 90 top
C45  106.68,44.45 90 top
C46  106.68,67.94 90 top
C47  106.68,32.38 90 top
C48  106.68,55.88 90 top
C49  33.02,31.11 0 top
C50  31.11,27.3 90 top
C51  25.4,27.3 90 top
CON1  134.94,63.18 90 top
CON2  134.94,51.12 90 top
CON3  134.94,39.05 90 top
CON4  134.94,26.99 90 top
D1  64.77,72.39 0 top
D2  43.81,67.63 180 top
D3  98.74,77.47 0 top
D4  33.97,53.02 0 top
D5  89.85,27.3 90 top
IC1  89.53,72.07 0 top
IC2  21.59,69.22 0 top
IC3  42.86,21.91 270 top
IC4  47.62,64.45 0 top
IC5  63.18,39.37 0 top
IC6  15.24,27.94 0 top
IC7  61.59,16.19 90 top
IC8  63.18,28.89 90 top
IC9  14.61,44.45 90 top
IC10  86.68,27.94 270 top
IC11  109.86,43.18 270 top
IC12  109.86,67.31 270 top
IC13  109.86,31.11 270 top
IC14  109.86,55.24 270 top
IC15  33.34,28.57 0 top
IC16  28.26,27.62 270 top
IC17  50.16,47.62 90 top
L1  46.04,76.52 0 top
L2  10.48,42.55 270 top
L3  94.93,20 0 top
PANEL  89.53,84.77 180 top
Q1  66.36,79.06 270 top
Q2  63.18,66.36 90 top
Q3  19.68,52.39 180 top
Q4  77.79,31.75 0 top
Q5  35.88,63.5 0 top
Q6  74.61,31.75 180 top
Q7  38.42,53.02 180 top
Q8  14.92,68.26 0 top
Q9  120.33,41.59 270 top
Q10  120.33,65.72 270 top
Q11  107.95,21.59 270 top
Q13  120.33,29.53 270 top
Q14  120.33,53.66 270 top
Q15  32.38,62.55 270 top
Q16  107.63,25.08 180 top
R1  92.39,72.07 90 top
R2  94.61,72.07 270 top
R3  17.78,70.48 90 top
R4  17.78,66.36 90 top
R5  56.2,83.5 0 top
R6  68.9,61.91 180 top
R7  89.85,77.47 180 top
R8  21.59,74.93 180 top
R9  15.24,48.26 90 top
R10  17.46,48.26 270 top
R11  19.68,48.26 90 top
R12  38.42,38.73 180 top
R13  74.61,34.92 0 top
R14  105.09,21.59 270 top
R15  15.88,8.89 0 top
R16  15.24,11.75 270 top
R17  15.24,17.46 90 top
R18  17.14,19.37 270 top
R19  19.68,8.89 180 top
R20  20,11.75 270 top
R21  20,17.46 90 top
R22  21.91,19.37 270 top
R23  9.53,8.57 180 top
R24  10.48,11.75 270 top
R25  10.48,17.46 90 top
R26  12.38,19.37 270 top
R27  9.84,45.4 0 top
R28  55.24,23.5 90 top
R29  57.15,23.5 90 top
R30  70.48,31.75 270 top
R31  68.26,33.02 270 top
R32  54.61,31.11 0 top
R33  54.61,29.21 0 top
R34  54.61,34.92 0 top
R35  54.61,33.02 0 top
R36  32.7,65.72 180 top
R37  81.28,24.45 270 top
R38  83.19,24.45 90 top
R39  82.23,20.32 270 top
R41  108.58,10.16 180 top
R42  107.31,13.34 270 top
R43  109.86,13.34 270 top
R44  112.08,11.43 270 top
R45  105.09,11.43 270 top
R46  85.72,10.16 180 top
R47  84.45,13.65 270 top
R48  87,13.65 270 top
R49  89.22,11.43 270 top
R50  82.23,11.75 270 top
R51  28.26,61.59 0 top
R52  105.09,25.72 90 top
U$1  5,5 0 top
U$2  5,85 0 top
U$3  135,85 0 top
U$4  135,5 0 top
X3  48.9,3.49 0 top
X4  71.12,22.86 270 top
X5  15.24,3.17 180 top
X6  42.86,34.61 0 top
X7  33.97,49.85 0 top
X12  26.35,3.17 0 top
X13  33.97,3.17 0 top
X14  108.58,3.49 0 top
X15  85.72,3.49 0 top
XTAL1  32.7,20.32 270 top
XTAL2  34.29,15.24 270 top

### Tracks (layer width: path | path; a pad name or v marks a point on that pad's centre or on a via)
5V_ON  (via drill 0.6)
  Top 0.305: IC10.3 86.04,32.07 81.92,32.07 81.92,49.53 v82.23,49.53 | v82.23,53.34 82.23,54.29 56.83,54.29 v56.83,53.34 | IC17.11 46.67,51.44 v46.67,54.29
  Bottom 0.305: v56.83,53.34 46.67,53.34 v46.67,54.29 | v82.23,53.34 v82.23,49.53
+5V  (via drill 0.6)
  Top 0.305: R44.2 110.81,10.48 110.81,4.45 105.08,4.45 | R49.2 R45.2 v105.09,7.62 | 80.96,23.5 R37.2 80.96,23.5 80.96,17.14 80.33,17.14 80.33,16.83 | 93.98,20 94.93,20 L3.2
  Top 1.27: v105.09,7.62 105.08,7.29 X14.1 105.08,4.45 105.08,2.54 105.09,0.95 82.22,0.95 X15.1 R50.2 80.33,10.8 80.33,16.83 94.3,16.83 94.3,20 94.93,20
  Bottom 0.305: v82.23,7.62 82.23,6.2 X15.1
  Bottom 1.27: v105.09,7.62 105.09,6.03
  pour Top (isolate 0.305, no thermals): 101.92,27.3 101.92,18.1 93.66,18.1 93.66,27.3
BACKLIGHT  (via drill 0.6)
  Top 0.305: IC3.21 v53.34,20.64 | v56.83,20.64 56.83,15.24 66.36,15.24 66.36,17.78 X4.5 v72.39,17.78
  Bottom 0.305: v53.34,20.64 v56.83,20.64
BATTERY  (via drill 0.6)
  Top 0.406: IC2.5 21.59,71.75 20.69,72.66 R8.2 | R3.2 17.78,73.34 | Q11.2 106.68,20.64 106.68,20.32 | R14.2 | R14.2 105.09,20.32
  Top 0.61: IC10.2 87.31,33.02 C40.1 | 87.5,36.83 C41.2
  Top 0.813: C40.1 C35.1 87.5,36.83 | v127.64,20.32 106.68,20.32 105.09,20.32 103.82,20.32 102.55,20.32 102.55,38.42 87.63,38.42 C41.2
  Top 2.54: BATTERY.1 19.37,88.58 127.64,88.58 v127.64,75.88 v127.64,74.61
  Bottom 0.813: v127.64,20.32 127.64,24.45
  Bottom 2.54: CON3.1 127.64,36.51 | 127.64,36.51 127.64,24.45 CON4.1 | 127.64,60.64 127.64,48.58 | 127.64,36.51 127.64,48.58 | 127.64,48.58 CON2.1 | CON1.1 127.64,60.64 | 127.64,60.64 v127.64,75.88
  other vias: 18.73,80.64 20,80.64
  pour Top (isolate 0.305, no thermals): 21.27,73.03 21.27,89.85 17.46,89.85 17.46,73.03
  pour Bottom (isolate 0.305, no thermals): 17.46,89.85 21.27,89.85 21.27,79.38 17.46,79.38
BUCK_ON  (via drill 0.6)
  Top 0.305: IC1.3 90.19,68.9 | C3.1 89.85,67.63 90.49,67.63 90.49,56.83 43.5,56.83 | 43.5,56.83 v43.5,56.52 | IC17.14 43.5,47.62 43.5,51.75 v43.18,51.75 | IC2.3 22.24,66.04 C4.1 22.54,63.5 v29.53,63.5 | v29.53,63.5 Q15.1 | 43.5,56.83 30.48,56.83 v30.48,56.52 | v29.53,63.5
  Top 0.406: 90.19,68.9 C3.1
  Bottom 0.305: v43.5,56.52 43.5,51.75 v43.18,51.75 | v30.48,56.52 29.21,56.52 29.21,63.5 v29.53,63.5
BUCK_SUPPLY
  Top 0.305: IC4.1 42.23,66.36 | 42.23,66.36 C5.1 | C5.1 | C5.1 C7.1 | C7.1 | D2.A 42.23,67.63 42.23,66.36 | C7.1 35.88,66.36 Q5.3
BUTTON
  Top 0.305: IC6.11 15.24,28.89 | R26.1 10.48,20.32 10.48,28.26 15.24,28.26 15.24,28.89 | IC3.2 36.2,28.26 36.2,33.66 20,33.66 20,28.89 15.24,28.89
D1+  (via drill 0.6)
  Top 0.305: 87,12.38 R49.1 | 87,12.38 87,10.16 R46.1 86.67,8.26 v86.68,7.62 86.68,6.25 X15.3 | 87,12.38 R48.2
  Bottom 0.305: v86.68,7.62 86.68,6.03
D1-
  Top 0.305: R50.1 R47.2 84.45,10.16 R46.2 84.78,6.25 X15.2
D2+
  Top 0.305: R44.1 R43.2 109.86,10.16 R41.1 109.53,6.2 X14.3
D2-
  Top 0.305: R45.1 R42.2 107.31,10.16 R41.2 107.64,6.2 X14.2
ENC_A  (via drill 0.6)
  Top 0.305: R16.2 15.24,8.89 R15.1 14.93,6.35 16.51,6.35 v16.51,4.45 X5.2
ENC_A2
  Top 0.305: R18.2 R17.2 15.24,21.91 12.7,21.91 IC6.2
ENC_B  (via drill 0.6)
  Top 0.305: R20.2 20,8.89 | X5.1 v19.05,4.45 19.05,6.35 20,6.35 20,8.89 | 20,8.89 R19.1
ENC_B2
  Top 0.305: R22.2 R21.2 20,23.18 16.51,23.18 IC6.5
ENC_PB  (via drill 0.6)
  Top 0.305: R24.2 10.48,8.89 R23.1 10.48,6.35 13.97,6.35 v13.97,4.45 X5.3
ENC_PB2
  Top 0.305: R26.2 R25.2 10.48,19.68 9.84,19.68 9.84,28.89 13.97,28.89 IC6.12
FAN_ON
  Top 0.305: IC17.12 47.62,50.16 47.62,55.24 44.45,55.24 44.45,53.34 39.37,53.34 Q7.1
GND  (via drill 0.6)
  Top 0.305: X6.5 v47.94,33.34
  Top 0.457: 16.19,44.13 14.61,44.13
  Top 0.61: 106.36,43.18 C45.1
  Bottom 0.305: v28.89,4.45 X12.3 | v36.51,4.45 X13.3
  other vias: 75.88,73.03 75.88,71.75 35.88,70.48 35.88,68.58 23.81,80.64 25.08,80.64 86.36,81.28 87.63,81.28 106.68,48.9 25.08,67.31 73.03,69.85 73.03,68.26 84.77,23.18 17.78,12.06 12.7,12.06 32.07,32.7 33.02,26.35 33.66,23.5 106.68,53.34 106.68,37.47 39.37,62.23 36.51,55.24 17.78,63.5 20.95,64.14 105.09,28.89 106.68,64.45 98.42,44.45 83.5,35.56 83.19,26.99 54.29,15.88 78.42,37.15 15.56,37.78 17.14,33.02 57.47,50.16 8.57,16.51 17.14,37.78 22.86,25.4 36.2,43.18 26.67,15.24 72.39,22.86 11.43,4.45 112.08,7.62 89.22,7.62
  pour Top (isolate 0.305, rank 2, no thermals): 2,90 138,90 arc-90 140,88 140.04,2 arc-91 138,0 2,0 arc-90 0,2 0,88 arc-90
  pour Bottom (isolate 0.305, rank 2, no thermals): 0,88 arc-90 2,90 138,90 arc-90 140,88 140,2 arc-90 138,0 2,0 arc-90 0,2
HI  (via drill 0.6)
  Top 0.305: IC3.23 v49.21,23.18 | v26.35,38.73 26.35,39.05 29.53,39.05 29.53,57.47 49.99,57.47 IC4.5
  Bottom 0.305: v49.21,23.18 46.04,23.18 46.04,25.08 26.35,25.08 v26.35,38.73
IIN_SENSE  (via drill 0.6)
  Top 0.305: IC5.11 66.99,39.37 66.99,40.96 69.85,40.96 69.85,52.39 78.11,52.39 78.11,51.75 83.82,51.75 83.82,53.66 91.44,53.66 v91.44,53.02 | IC1.6 88.89,72.07 91.12,72.07 91.12,57.15 v91.44,57.15
  Bottom 0.305: v91.44,53.02 v91.44,57.15
IOUT_SENSE  (via drill 0.6)
  Top 0.305: IC2.6 20.94,68.9 19.68,68.9 19.68,59.37 46.35,59.37 v46.35,59.69 | IC5.3 62.23,40.64 62.23,44.77 59.37,44.77 59.37,51.44 v59.69,51.44
  Bottom 0.305: v59.69,51.44 59.69,53.34 59.37,53.66 59.37,59.69 v46.35,59.69
LCD_PWR  (via drill 0.6)
  Top 0.305: X4.4 v72.39,20.32 73.98,20.32 73.98,30.8 74.61,30.8 Q6.3
LI  (via drill 0.6)
  Top 0.305: IC3.22 v49.21,21.91 | v25.4,39.69 28.89,39.69 28.89,58.1 48.58,58.1 48.58,63.82 IC4.6
  Bottom 0.305: v49.21,21.91 45.4,21.91 45.4,24.45 25.72,24.45 25.72,37.78 25.4,38.1 v25.4,39.69
MCLR  (via drill 0.6)
  Top 0.305: 39.05,36.51 45.4,36.51 X6.4 v45.4,33.34 | 39.05,36.51 39.05,29.53 IC3.1 | 39.05,36.51 39.05,38.73 R12.1
N$1
  Top 0.305: IC4.2 46.67,65.09 46.67,67.63 D2.C
  Top 0.61: IC4.2 42.86,65.09 C6.2
N$2
  Top 0.305: R13.2 Q6.1 Q4.3
N$3
  Top 0.305: R14.1 Q11.1 107.63,22.54 Q16.3
N$4
  Top 0.305: R5.2 60.71,83.5 Q1.1
N$5
  Top 0.305: Q3.3 R11.2
N$6
  Top 0.305: R21.1 C28.1 R20.1
N$7
  Top 0.305: Q2.1 69.85,63.82 R6.1
N$8
  Top 0.305: IC4.8 53.66,66.36 53.66,60.33 65.41,60.33 65.41,61.91 R6.2
N$9
  Top 0.406: L2.1 10.48,44.12
  Top 0.457: 10.48,44.12 IC9.7
N$10  (via drill 0.6)
  Top 0.305: v35.24,48.58 X7.2
  Top 0.61: Q7.3 38.42,49.85 X7.2 35.24,53.02
  Top 0.813: D4.A 35.24,53.02
N$11
  Top 0.305: C17.2 R9.1 R10.2 R11.1 | IC9.5 13.21,47.31
  Top 0.406: 13.21,47.31 C17.2
N$12
  Top 0.305: R17.1 C27.1 R16.1
N$13
  Top 0.305: R25.1 C29.1 R24.1
N$14
  Top 0.305: IC4.3 47.31,63.82 47.31,83.5 R5.1
N$15
  Top 0.61: IC3.6 35.56,23.18 | 35.56,23.18 | 35.56,23.18 C20.2
N$16
  Top 0.305: Q5.1 34.93,62.55 Q15.3 33.48,65.72 R36.1
N$17
  Top 0.305: Q8.3 17.78,69.36 R3.1
N$18
  Top 0.305: IC10.1 89.54,30.54 C34.1
N$19
  Top 0.305: Q15.2 R51.2
N$20
  Top 0.305: C42.2 83.19,30.54 IC10.4
N$21  (via drill 0.6)
  Top 0.61: C34.2 91.44,31.43 v92.71,31.43
  Bottom 0.61: v91.44,25.72 91.44,31.43 v92.71,31.43
  pour Top (isolate 0.305, no thermals): 93.03,18.1 88.27,18.1 88.27,26.35 93.03,26.35
N$22
  Top 0.305: IC10.5 83.19,25.34 R38.2 R37.1
N$23  (via drill 0.6)
  Top 0.305: v132.72,40.96 130.81,41.59 v132.72,42.23
  Top 2.54: CON3.2 130.81,41.59 Q9.TAB
  Bottom 2.54: CON3.2 130.81,41.59
N$24
  Top 0.61: IC11.5 114.37,44.13 Q9.1
N$25
  Top 0.305: C44.1 R39.2
N$26
  Top 0.305: C44.2 C43.2 IC10.6
N$27  (via drill 0.6)
  Top 0.305: v132.72,66.36 132.72,65.72 v132.72,65.09
  Top 2.54: CON1.2 132.72,65.72 Q10.TAB
  Bottom 2.54: CON1.2 132.72,65.72
N$28
  Top 0.61: IC12.5 114.37,68.26 Q10.1
N$29  (via drill 0.6)
  Bottom 0.305: v109.54,7.62 109.54,6.03
N$30  (via drill 0.6)
  Top 0.305: v132.72,28.89 130.81,29.53 v132.72,30.16
  Top 2.54: CON4.2 130.81,29.53 Q13.TAB
  Bottom 2.54: CON4.2 130.81,29.53
N$31
  Top 0.61: Q13.1 IC13.5
N$32  (via drill 0.6)
  Top 0.305: v132.72,53.02 133.03,53.66 v132.72,54.29
  Top 2.54: Q14.TAB 133.03,53.66 CON2.2
  Bottom 2.54: CON2.2 133.03,53.66
N$33
  Top 0.61: Q14.1 IC14.5
N$34
  Top 0.305: Q16.2 106.68,26.67 R52.2
N$35  (via drill 0.6)
  Bottom 0.305: v107.63,7.62 107.63,6.03
N$36  (via drill 0.6)
  Bottom 0.305: v47.62,10.16 47.62,8.26
N$37  (via drill 0.6)
  Bottom 0.305: v84.77,7.62 84.77,6.03
N$38  (via drill 0.6)
  Bottom 0.305: v50.16,10.16 50.16,8.26
N$39  (via drill 0.6)
  other vias: 106.05,77.47
OSC1
  Top 0.305: C22.2 29.52,22.52 XTAL1.1 32.7,22.52 32.7,20.95 34.61,20.95 34.61,19.37 IC3.9
OSC2
  Top 0.305: C23.2 33.9,20.32 XTAL1.3 38.08,18.12 IC3.10
OUT1_ON  (via drill 0.6)
  Top 0.305: IC3.7 39.69,21.91 v39.69,11.11 | IC12.3 108.56,58.1 93.34,58.1 v93.34,57.15 | v93.34,51.12 93.34,51.44 89.85,51.44 89.85,52.39 85.09,52.39 85.09,50.48 81.28,50.48 81.28,27.94 75.25,27.94 75.25,11.11 v52.07,11.11
  Bottom 0.305: v93.34,57.15 v93.34,51.12 | v52.07,11.11 v39.69,11.11
OUT2_ON  (via drill 0.6)
  Top 0.305: IC3.13 36.51,14.29 v36.51,12.06 | IC14.3 108.58,54.29 108.58,52.39 104.78,52.39 104.78,56.2 94.61,56.2 v94.61,56.52 | v94.61,52.07 90.49,52.07 90.49,53.02 84.45,53.02 84.45,51.12 80.64,51.12 80.64,28.57 74.61,28.57 74.61,12.06 v51.12,12.06
  Bottom 0.305: v94.61,56.52 v94.61,52.07 | v51.12,12.06 v36.51,12.06
OUT3_ON
  Top 0.305: IC11.3 104.14,42.23 104.14,55.56 48.9,55.56 48.9,45.09 IC17.16
OUT4_ON
  Top 0.305: IC13.3 103.5,30.16 103.5,54.93 49.53,54.93 49.53,43.81 IC17.17
OUT_ON  (via drill 0.6)
  Top 0.305: 111.12,42.2 IC11.4 111.12,42.23 v111.12,40.64 v111.12,33.34 | IC12.4 111.12,66.36 v111.12,59.05 | IC14.4 111.12,54.3 v111.12,53.02 v111.12,45.4 | Q16.1 108.58,26.67 v108.58,28.89 | v111.12,28.89 111.12,30.16 IC13.4 | IC17.13 48.26,48.9 48.26,56.2 92.39,56.2 92.39,58.74 107.63,58.74 v107.63,59.05
  Bottom 0.305: v111.12,53.02 v111.12,59.05 v107.63,59.05 | v111.12,45.4 v111.12,40.64 | v111.12,33.34 v111.12,28.89 v108.58,28.89
OUT_PWR
  Top 0.61: C45.2 108.56,45.4 IC11.1 109.86,44.13 | 109.86,44.13 109.86,32.06 | 109.86,56.2 109.86,68.26 IC12.1 107.92,68.89 C46.2 | 109.86,44.13 109.86,56.2 | 109.86,56.2 IC14.1 | IC14.1 | 109.86,32.06 IC13.1 108.58,32.06 108.58,33.34 C47.2 | IC14.1 107.92,56.83 C48.2 | 109.86,32.06 109.86,21.59 Q11.3
PANEL  (via drill 0.6)
  Top 0.305: IC1.4 92.71,73.27 R1.2
  Top 0.406: IC1.4 90.19,74.31 90.81,74.93 90.81,77.42 R7.1 D3.C
  other vias: 91.44,81.28 92.71,81.28
  pour Top (isolate 0.305, no thermals): 93.98,75.56 93.98,87 90.17,87 90.17,75.56
  pour Bottom (isolate 0.305, no thermals): 93.98,87 93.98,80.33 90.17,80.33 90.17,87
PGC  (via drill 0.6)
  Top 0.305: R22.1 21.91,23.81 17.78,23.81 IC6.6 17.78,26.99 21.91,26.99 21.91,30.48 v29.21,30.48 | IC3.27 40.32,28.26 v40.32,33.34 X6.2
  Bottom 0.305: X6.2 v40.32,33.34 40.32,30.16 29.21,30.16 v29.21,30.48
PGD  (via drill 0.6)
  Top 0.305: R18.1 17.14,22.54 13.97,22.54 IC6.3 13.97,26.99 16.83,26.99 16.83,27.62 21.27,27.62 21.27,32.38 28.26,32.38 v28.26,32.07 | IC3.28 42.86,29.53 v42.86,33.34 X6.3
  Bottom 0.305: X6.3 v42.86,33.34 42.86,29.53 28.26,29.53 v28.26,32.07
PWR_GOOD  (via drill 0.6)
  Top 0.305: IC9.6 12.06,44.77 12.06,45.4 R27.2 10.79,46.99 v9.53,46.99 | IC3.18 43.5,16.83 43.5,8.26 40.96,8.26 40.96,5.4 35.24,5.4 35.24,0.64 22.23,0.64 22.23,1.27 12.7,1.27 12.7,5.71 9.84,5.71 9.84,7.3 7.3,7.3 7.3,9.84 7.94,9.84 7.94,12.06 6.03,12.06 6.03,18.73 7.94,18.73 7.94,31.43 10.48,31.43 10.48,40.32 7.94,40.32 7.94,46.99 v7.62,46.99
  Top 0.406: R27.2
  Bottom 0.305: v7.62,46.99 v9.53,46.99
RTC1
  Top 0.305: IC3.11 35.88,16.83 35.88,16.49 XTAL2.1 32.06,16.49 C24.2
RTC2
  Top 0.305: IC3.12 35.88,15.56 35.88,13.99 XTAL2.2 32.06,13.99 C25.2
SCL  (via drill 0.6)
  Top 0.305: IC3.25 v55.24,25.72 R28.2 | IC8.14 v58.42,26.99
  Bottom 0.305: v58.42,26.99 55.24,26.99 v55.24,25.72
SCL0  (via drill 0.6)
  Top 0.305: IC8.5 71.12,29.53 X4.1 v72.39,27.94
SCL1
  Top 0.305: IC5.8 63.82,35.56 63.82,32.07 IC8.7 R31.2
SCL2
  Top 0.305: R35.2 57.78,33.02 57.78,32.07 IC8.10 62.23,32.07 62.23,34.29 59.05,34.29 59.05,35.56 57.47,35.56 55.24,37.78 55.24,42.55 IC17.1
SCL3
  Top 0.305: IC7.6 62.23,29.53 IC8.12 56.51,29.53 R33.2
SDA
  Top 0.305: IC3.26 57.15,26.99 57.15,25.72 | 57.15,25.72 IC8.15 | 57.15,25.72 R29.2
SDA0  (via drill 0.6)
  Top 0.305: IC8.4 68.9,28.26 68.9,25.4 X4.2 v72.39,25.4
SDA1
  Top 0.305: IC5.7 63.18,35.56 63.18,30.8 IC8.6 R30.2
SDA2
  Top 0.305: IC8.9 58.42,33.34 58.42,34.92 R34.2 | R34.2 56.52,34.92 | IC17.2 53.02,43.81 53.02,41.59 54.61,41.59 54.61,37.15 55.24,36.51 55.24,34.92 R34.2
SDA3
  Top 0.305: IC7.5 63.5,30.16 62.23,30.16 62.23,30.8 IC8.11 56.51,30.8 R32.2
SWITCHNODE
  Top 0.305: IC4.4 47.94,62.55 47.94,67.94 55.56,67.94
  Top 0.406: 55.56,67.94 55.56,65.72 Q2.TAB
  Top 0.61: IC4.4 42.55,62.55 C6.1
  pour Top (isolate 0.305, no thermals): 49.85,80.33 56.2,80.33 56.2,77.79 61.91,77.79 61.91,73.34 64.45,73.34 64.45,62.55 54.29,62.55 54.29,72.71 49.85,72.71
TEMP1
  Top 0.305: IC3.3 33.99,26.99 IC15.3
TEMP2  (via drill 0.6)
  Top 0.305: IC3.4 40.64,25.72 40.64,9.53 39.69,9.53 39.69,6.67 26.35,6.67 v26.35,4.45 X12.2
TEMP3  (via drill 0.6)
  Top 0.305: IC3.24 41.27,24.45 41.27,8.89 40.32,8.89 40.32,6.03 33.97,6.03 v33.97,4.45 X13.2
UI_ON  (via drill 0.6)
  Top 0.305: IC6.4 v15.24,23.5 | v11.43,23.5 IC6.1 11.43,27.62 16.19,27.62 16.19,28.26 20.64,28.26 20.64,33.02 30.16,33.02 v30.16,32.7 | v18.41,22.23 18.41,17.14 16.51,17.14 16.51,10.16 16.51,8.89 R15.2 R19.2 | v30.16,35.88 30.16,46.99 42.86,46.99 42.86,50.8 42.23,50.8 42.23,52.7 IC17.10 45.4,52.7 v45.4,53.66 | Q4.1 76.83,29.21 80.01,29.21 80.01,50.8 v79.69,50.8 | v79.69,53.34 79.69,53.66 57.78,53.66 v57.78,51.75
  Bottom 0.305: v11.43,23.5 v15.24,23.5 18.41,23.5 v18.41,22.23 | v30.16,32.7 v30.16,35.88 | v79.69,50.8 v79.69,53.34 | v45.4,53.66 45.4,52.7 55.88,52.7 55.88,51.75 v57.78,51.75
USB+  (via drill 0.6)
  Top 0.305: IC3.16 46.04,14.29 v46.04,10.16 46.04,6.2 X3.DATA+
  Bottom 0.305: v46.04,10.16 46.04,6.35 47.62,6.35
USB-
  Top 0.305: IC3.15 X3.DATA-
USB_SENSE
  Top 0.305: IC3.17 50.15,15.56 X3.+5V
VCC  (via drill 0.6)
  Top 0.305: L2.2 8.57,41.4 8.57,45.4 8.57,47.94 11.75,47.94 11.75,49.21 C17.1 R9.2 | R12.2 37.78,38.73 X6.1 v37.78,33.34 | Q6.2 R13.1 | IC17.3 IC17.4 IC17.5 IC17.6
  Top 0.406: 13.34,41.27 C15.1 13.21,41.91 | L2.2 10.48,41.27 | R27.1 8.57,45.4 | R31.1 70.48,33.97 R30.1 70.48,32.85 Q6.2 73.34,32.85 73.34,24.13 68.9,24.13 68.9,24.45 | IC8.1 68.9,24.45 | 68.96,24.45 68.9,24.45
  Top 0.457: IC9.8 13.21,41.91
  Top 0.61: 10.48,41.27 13.34,41.27 C16.1 11.43,39.69 11.43,34.61 | IC3.20 C19.1 | IC6.13 IC6.14 | IC6.14 11.43,33.02 | IC3.14 38.1,13.02 | 38.1,13.02 | 38.1,13.02 C21.2 v36.51,10.79 | IC8.16 60.65,24.45 | IC8.16 60.96,24.45 C30.1 60.96,22.55 59.69,22.55 | IC8.3 IC8.2 IC8.1 64.77,24.45 v64.77,23.18 | C33.1 58.1,18.55 IC7.8 59.69,22.55 | 59.69,22.55 R29.1 R28.1 54.61,22.55 | 54.61,22.55 54.61,19.37 IC3.20 | 52.07,42.55 IC17.18 45.09,42.55 C32.1 37.47,40.64 R12.2 35.88,38.73 35.88,34.61 11.43,34.61 | 52.07,42.55 52.07,45.09 IC17.3 57.15,45.09 57.15,37.47 57.78,36.83 C31.1 | IC5.6 C31.1 | C31.1 | 52.07,42.55 52.07,40.64 53.66,40.64 R34.1 R35.1 R32.1 R33.1 v52.07,29.21 | C26.1 11.43,33.02 | 11.43,33.02 11.43,34.61 | 54.61,22.55 53.66,22.55 53.66,24.77 v52.07,24.77 | R23.2 8.89,8.57 8.89,13.02 6.99,13.02 6.99,17.78 8.89,17.78 8.89,30.48 11.43,30.48 IC6.14 | IC3.20 42.23,19.37 v42.23,9.84 | IC8.16 v59.05,24.45
  Bottom 0.61: v52.07,29.21 v52.07,24.77 | v42.23,9.84 38.42,9.84 38.42,10.79 v36.51,10.79 | v59.05,24.45 64.77,24.45 v64.77,23.18
VCC_HIGH  (via drill 0.6)
  Top 0.305: X13.1 31.43,1.27 23.81,1.27 X12.1 v23.81,4.45 23.81,23.81 25.4,23.81 C51.1 | IC16.3 28.26,26.67 28.26,29.43 IC15.5 IC15.4 33.97,29.43 C49.2 v33.97,32.7 | IC17.15 31.11,46.35 v31.11,46.04 30.8,46.04 30.8,36.83 31.11,36.51 31.11,35.56 33.97,35.56 v33.97,35.88 | Q3.1 20.64,58.1 | 20.64,58.1 13.97,58.1 Q8.1 | v27.94,46.04 28.26,46.04 28.26,58.1 20.64,58.1
  Top 0.406: IC16.3 25.4,26.67 C51.1
  Bottom 0.305: v33.97,32.7 v33.97,35.88 | v31.11,46.04 v27.94,46.04 | v31.43,4.45 X13.1
VIN  (via drill 0.6)
  Top 0.406: 86.36,77.47 R7.2 89.22,77.2 89.22,74.61 89.53,74.3 IC1.5
  other vias: 75.88,78.11 75.88,76.83
  pour Top (isolate 0.305, no thermals): 89.53,79.38 89.53,75.56 65.09,75.56 65.09,82.55 74.61,82.55 74.61,79.38
  pour Bottom (isolate 0.305, no thermals): 83.82,75.56 83.82,79.38 74.61,79.38 74.61,75.56
VIN_SENSE  (via drill 0.6)
  Top 0.305: IC5.13 67.94,41.91 | 67.94,41.91 69.22,41.91 69.22,53.02 78.74,53.02 78.74,52.39 83.19,52.39 83.19,54.29 92.39,54.29 v92.39,53.98 | v92.39,60.64 91.76,60.64 91.76,69.85 92.39,69.85 R1.1 R2.2 | C9.1 67.94,41.91
  Bottom 0.305: v92.39,53.98 v92.39,60.64
VOUT  (via drill 0.6)
  Top 0.305: R36.2 v28.26,65.72 | 28.26,74.93 24.75,74.93 | Q5.2 36.83,63.5 34.92,63.5 34.92,66.99 31.75,66.99 R36.2 | R36.2 | v32.7,48.58 X7.1
  Top 0.406: IC2.4 22.24,71.74 22.23,71.75 22.49,72.02 R8.1 24.75,74.93 | 16.19,43.5 16.19,43.48 IC9.1
  Top 0.457: IC9.3 17.46,44.77 | 16.19,43.48 17.46,43.48
  Top 0.61: C14.1 C18.1 17.46,42.67 17.46,43.48 17.46,44.77 17.46,46.04 20.95,46.04 20.95,51.44 21.59,51.44 21.59,57.15 v27.3,57.15 | v28.26,65.72 28.26,74.93 | X7.1 32.7,53.02 v32.7,54.93
  Top 0.813: 32.7,53.02 D4.C
  Bottom 0.61: v28.26,65.72 28.26,57.15 | 28.26,57.15 28.26,55.24 32.7,55.24 v32.7,54.93 | v27.3,57.15 28.26,57.15
  other vias: 35.88,75.56 35.88,74.3
  pour Top (isolate 0.305, no thermals): 42.23,80.01 42.23,73.03 21.91,73.03 21.91,76.83 36.2,76.83 36.2,80.01
  pour Bottom (isolate 0.305, no thermals): 27.94,73.03 27.94,76.83 37.15,76.83 37.15,73.03
VOUT_SENSE  (via drill 0.6)
  Top 0.305: Q8.2 15.87,67.31 R4.2 19.05,67.31 19.05,58.74 47.62,58.74 v47.62,59.05 | 61.59,43.18 IC5.1 58.74,43.18 C8.1 v58.74,52.7
  Bottom 0.305: v47.62,59.05 58.74,59.05 v58.74,52.7
VREF
  Top 0.305: IC3.5 31.11,24.45 C50.1
  Top 0.406: IC16.4 31.11,26.67 C50.1

### Text on the board
tText: Panel | Battery | MPPT Solar Charger - soldernerd.com | 2016 | Rev A